# Altium schematic sheet 0238_GPU GDDR DEVICE DE.SchDoc
size 848 x 558 mm
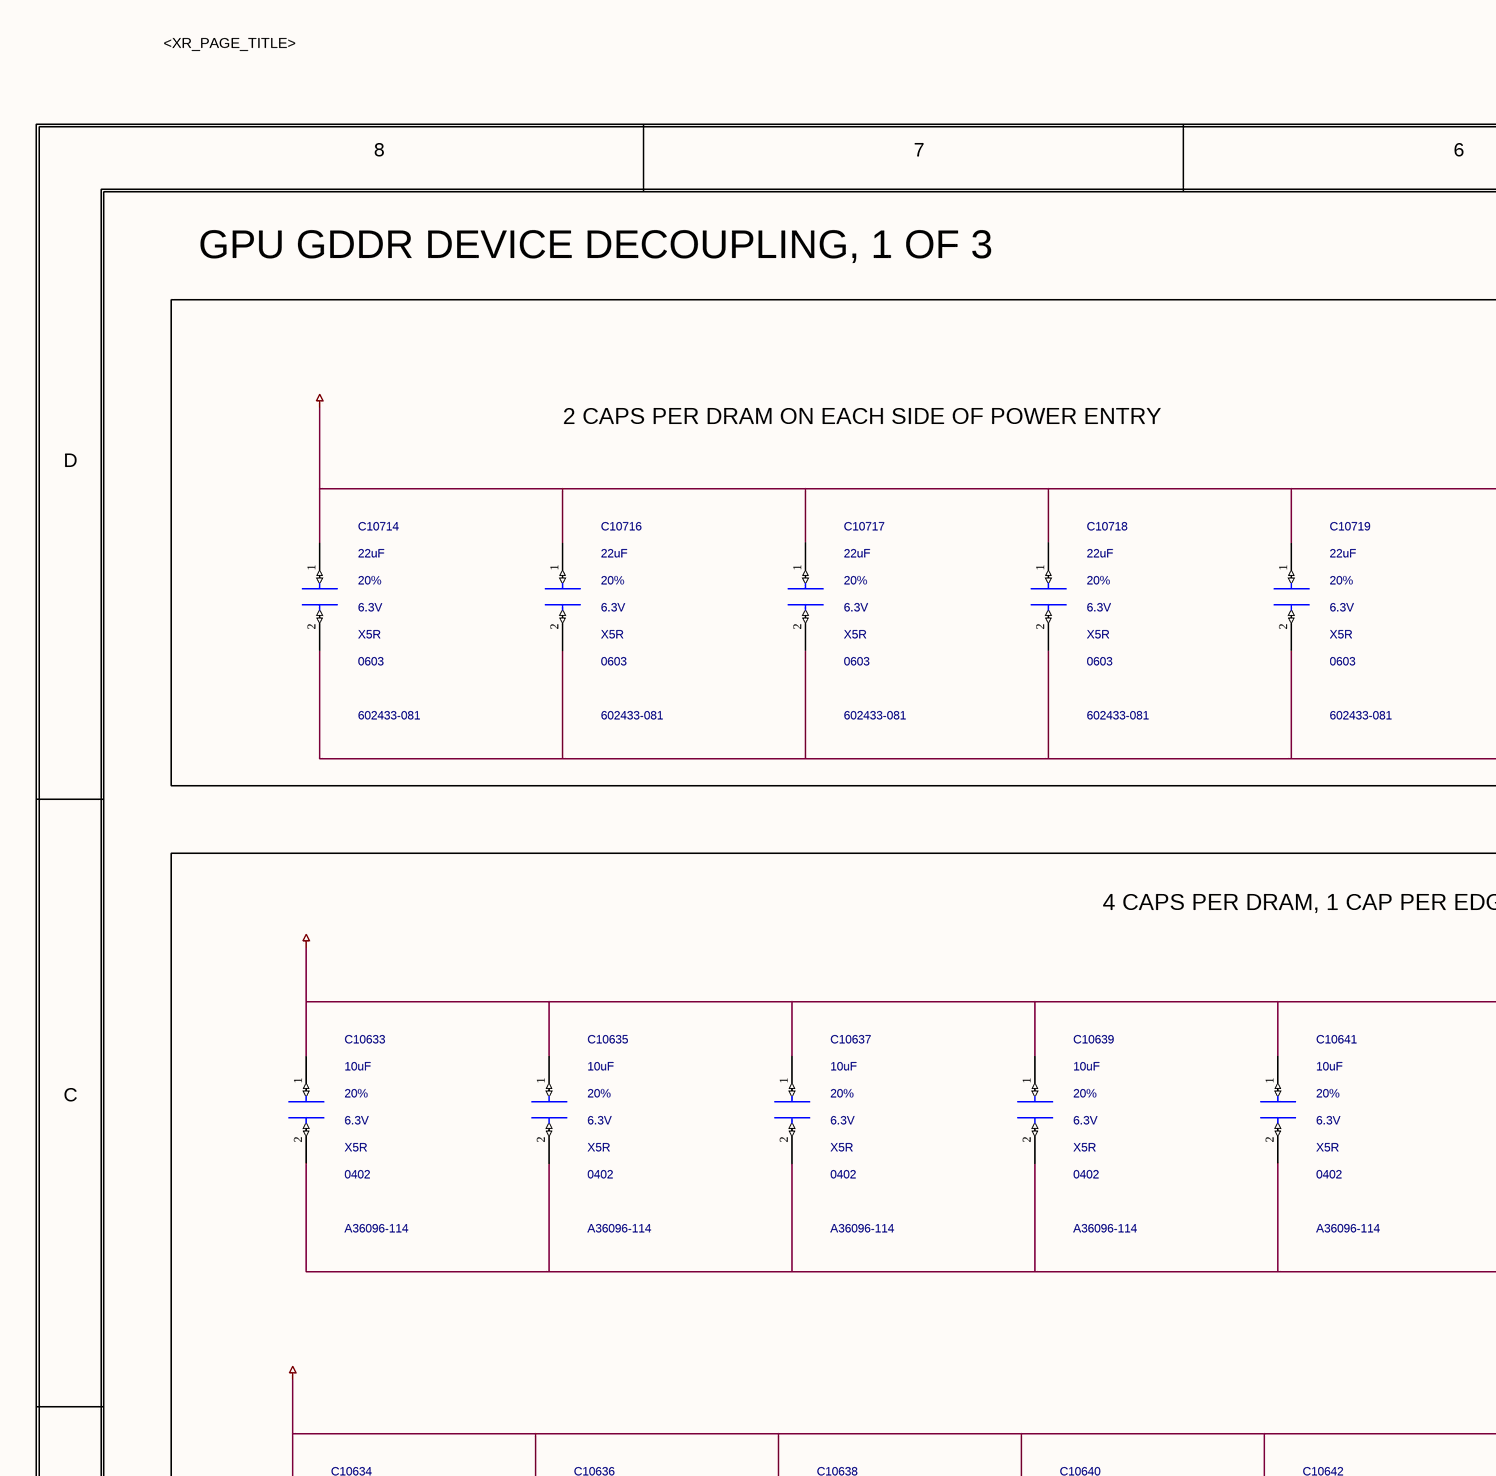
[diagram p0: 0238_GPU GDDR DEVICE DE.SchDoc, top left]
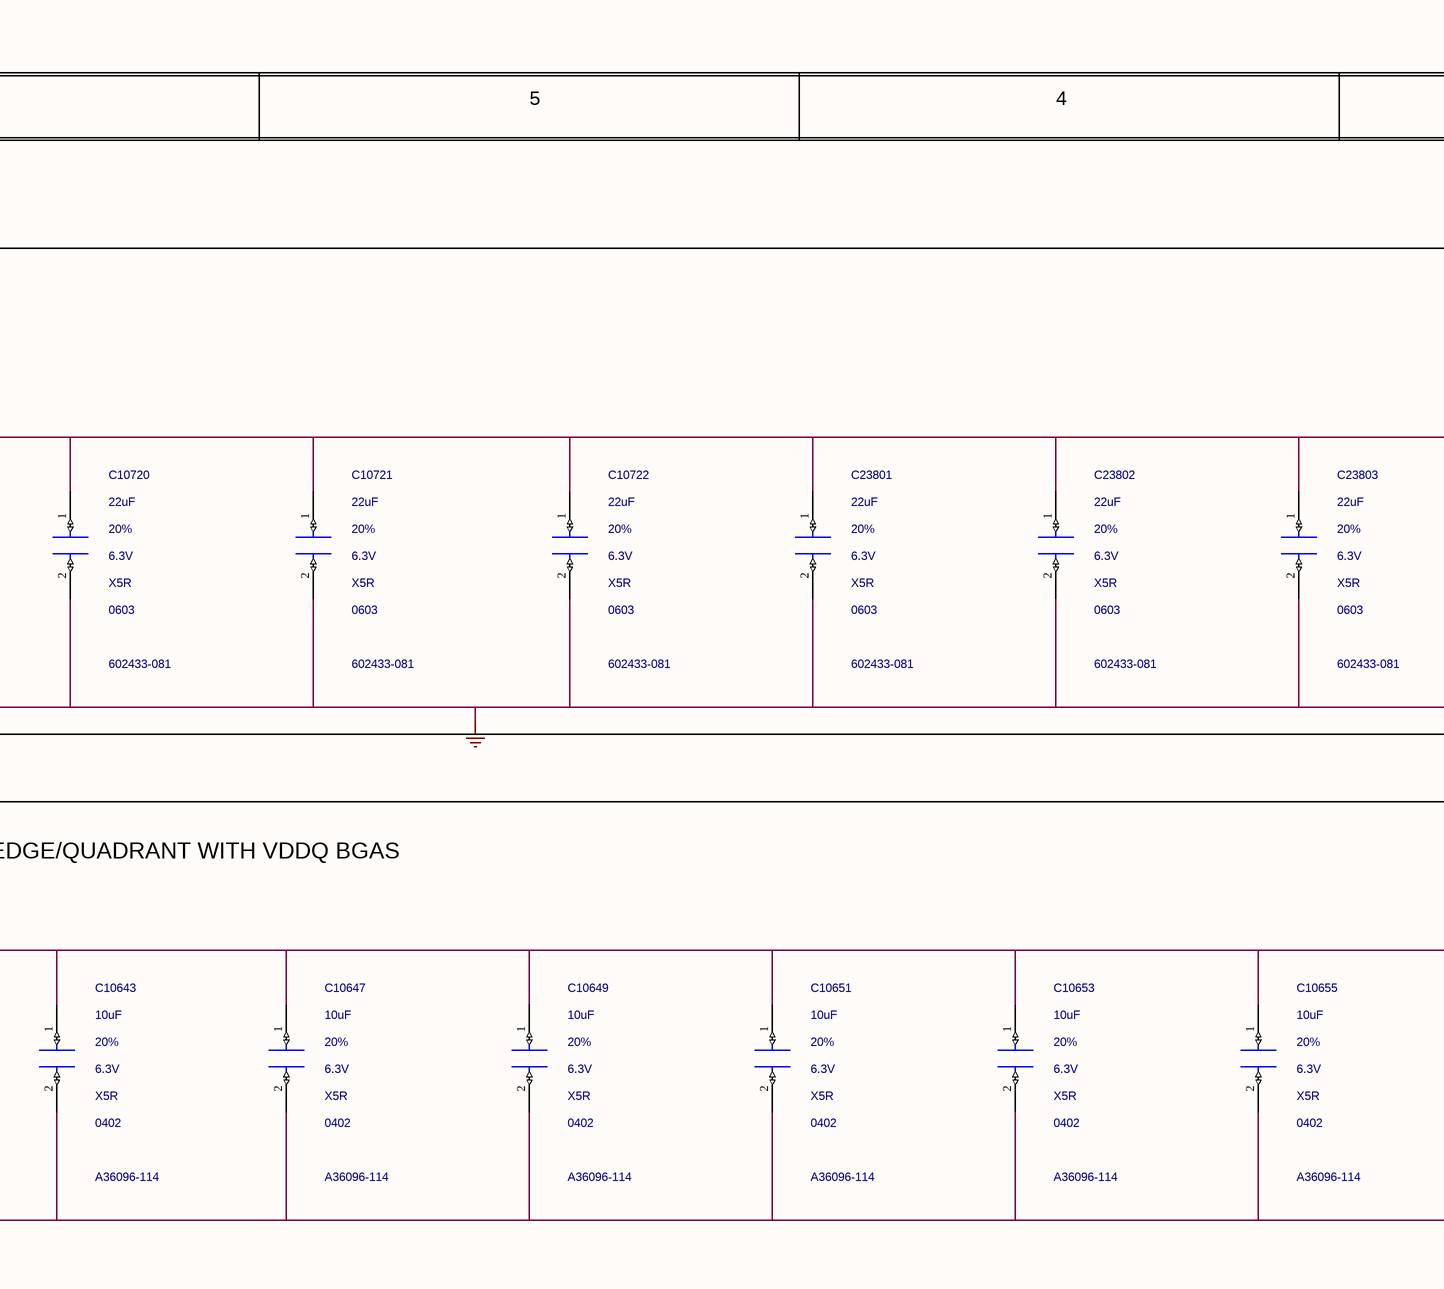
[diagram p1: 0238_GPU GDDR DEVICE DE.SchDoc, top middle]
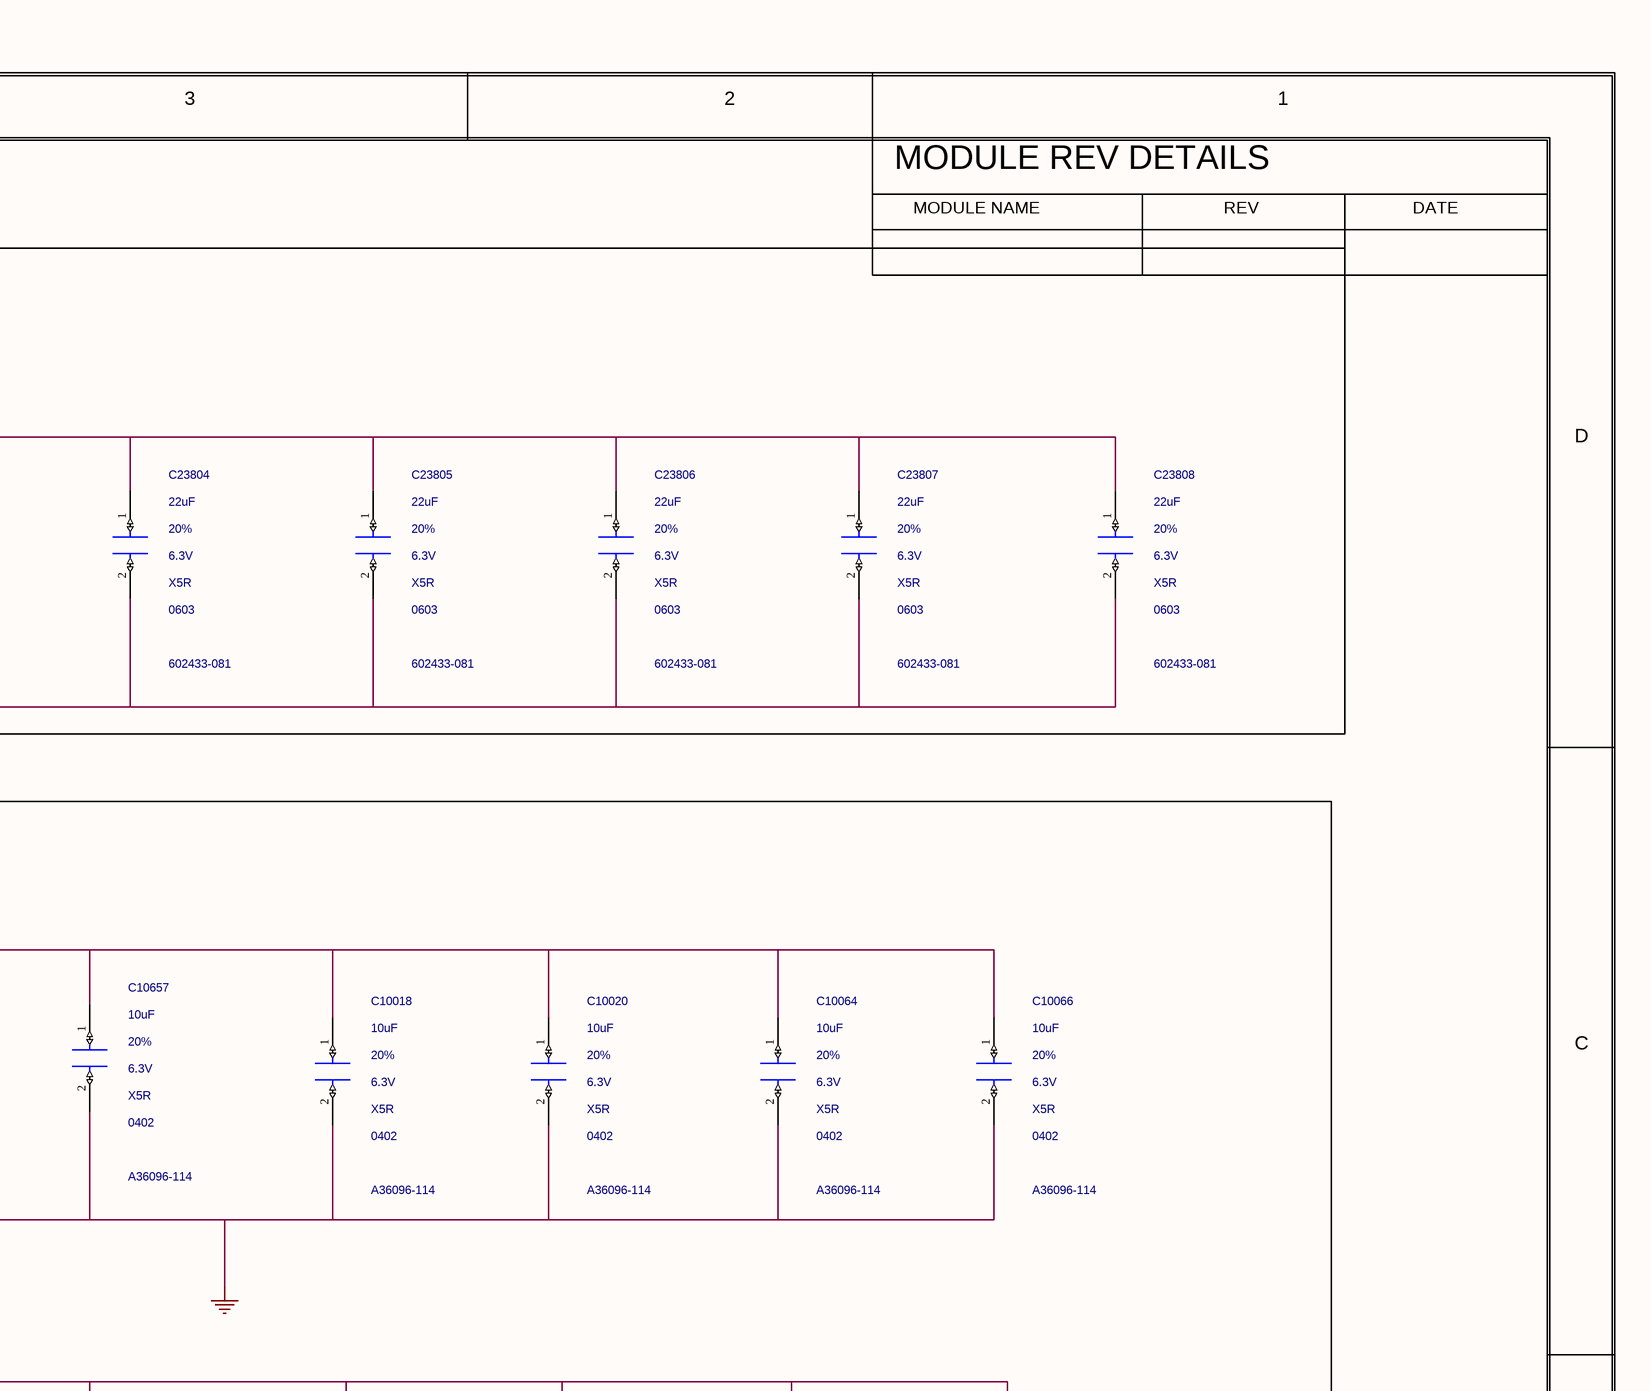
[diagram p2: 0238_GPU GDDR DEVICE DE.SchDoc, top right]
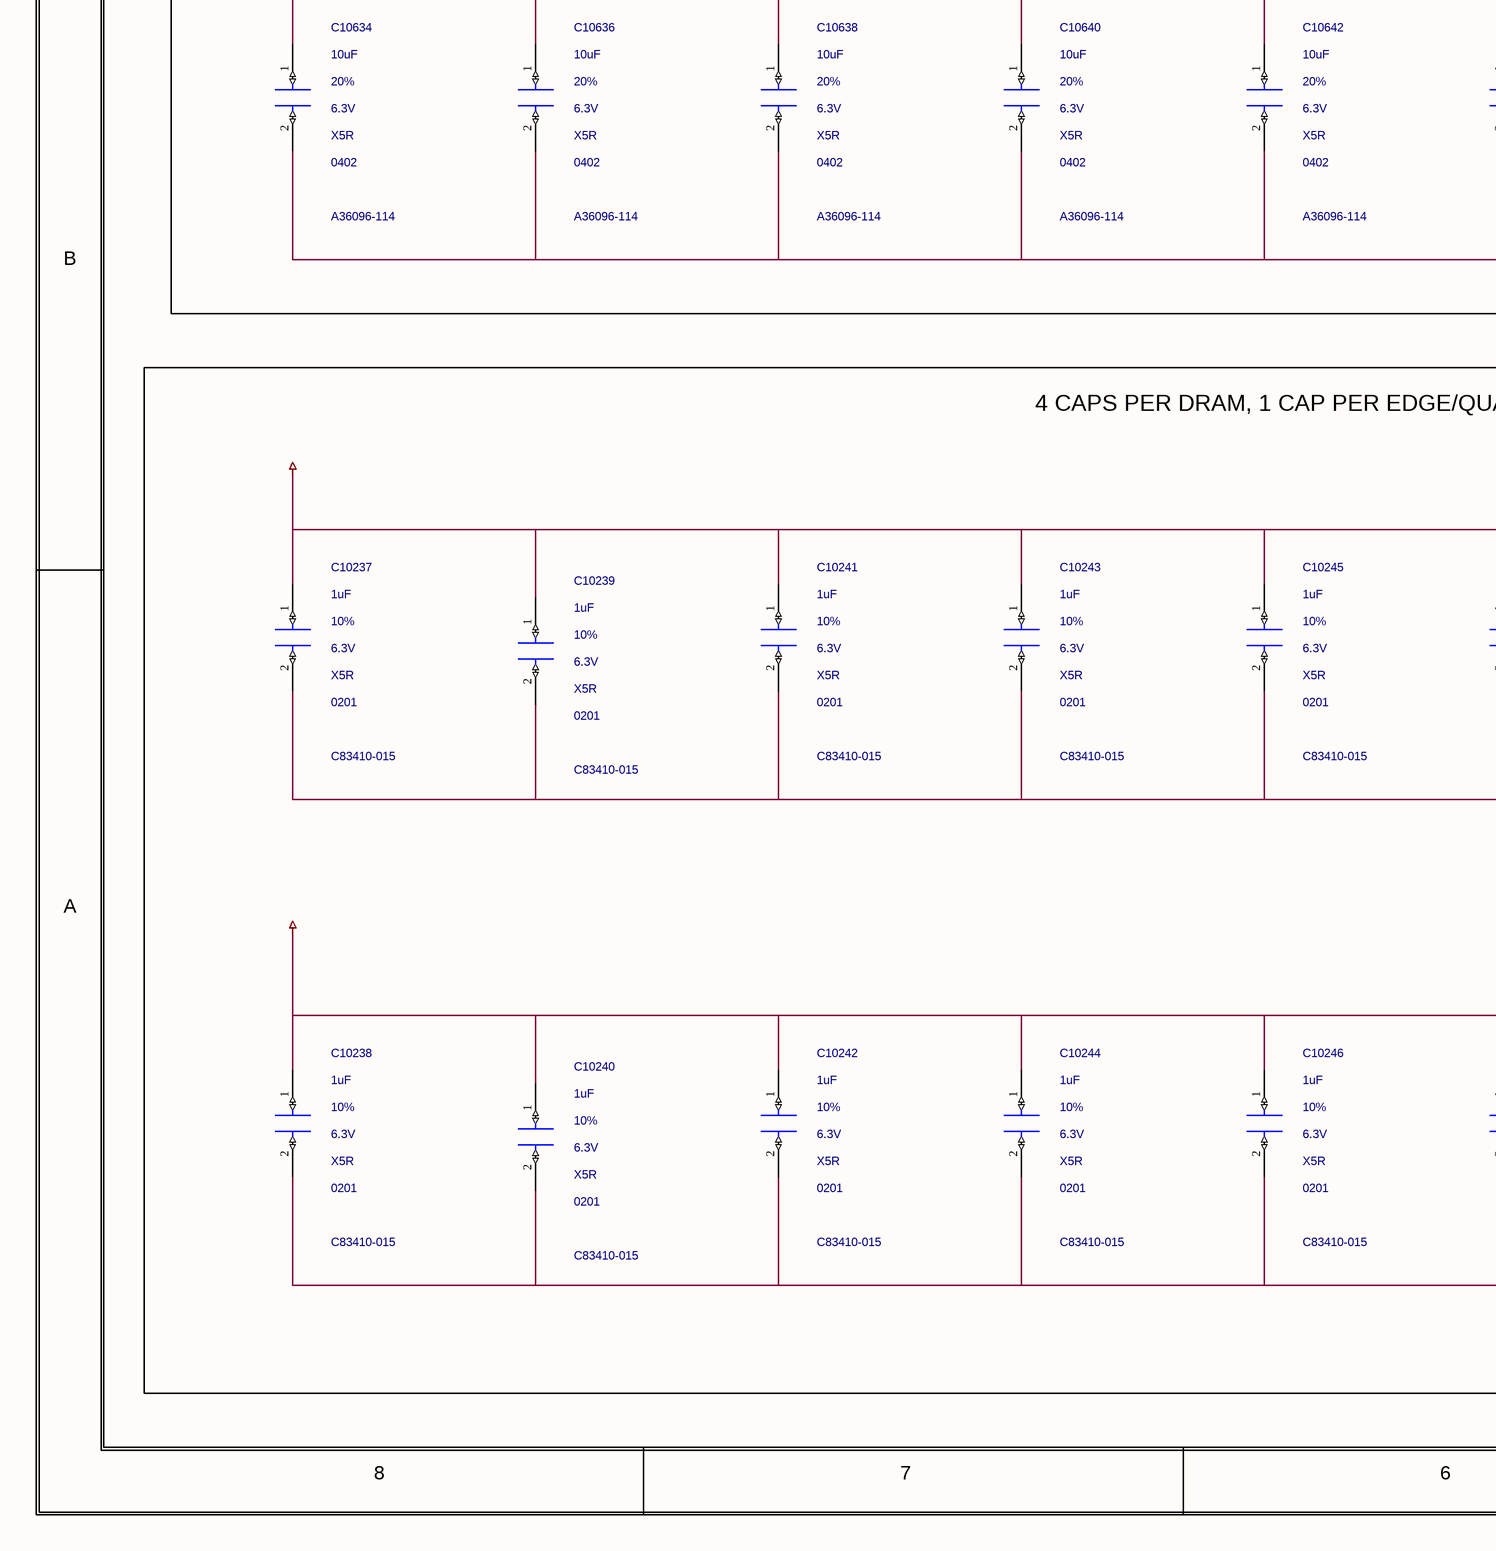
[diagram p3: 0238_GPU GDDR DEVICE DE.SchDoc, bottom left]
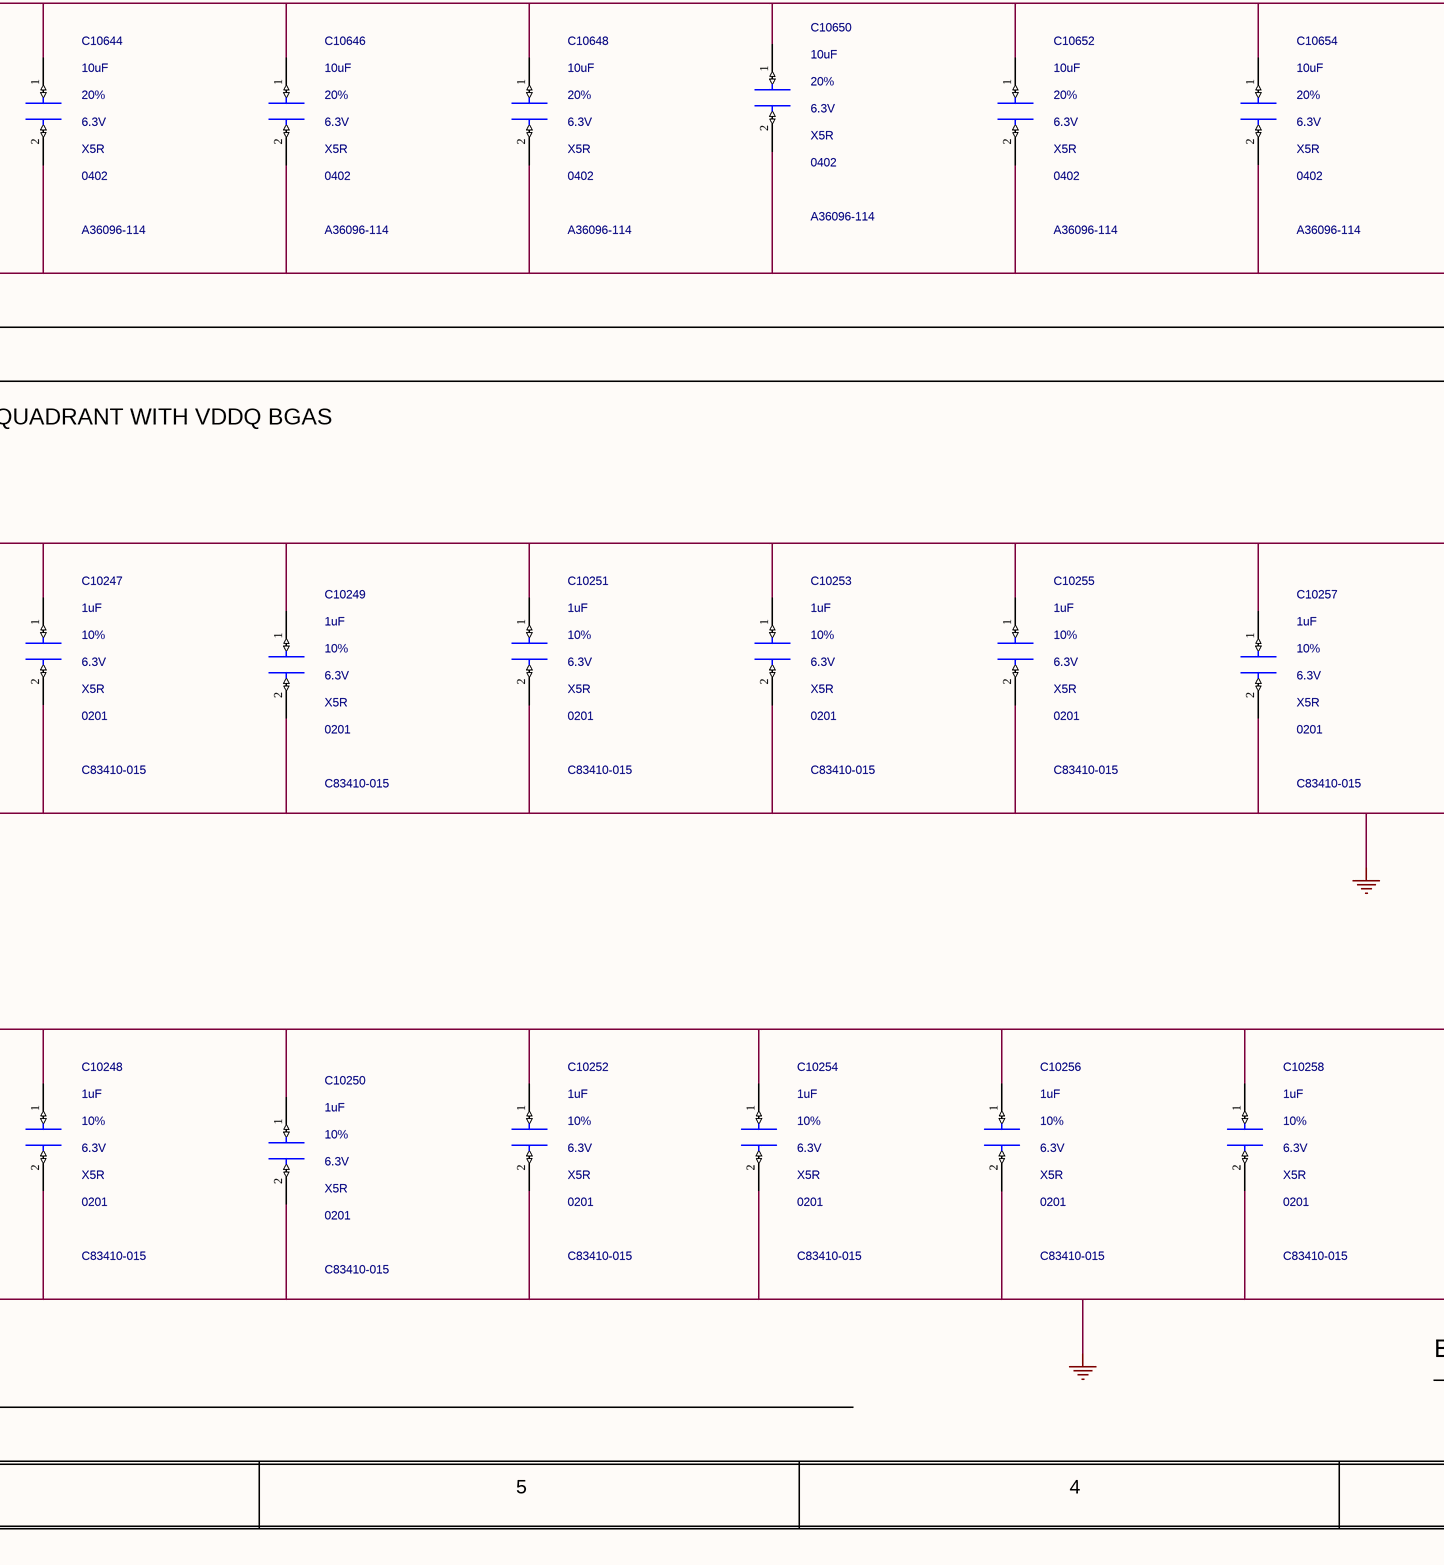
[diagram p4: 0238_GPU GDDR DEVICE DE.SchDoc, bottom middle]
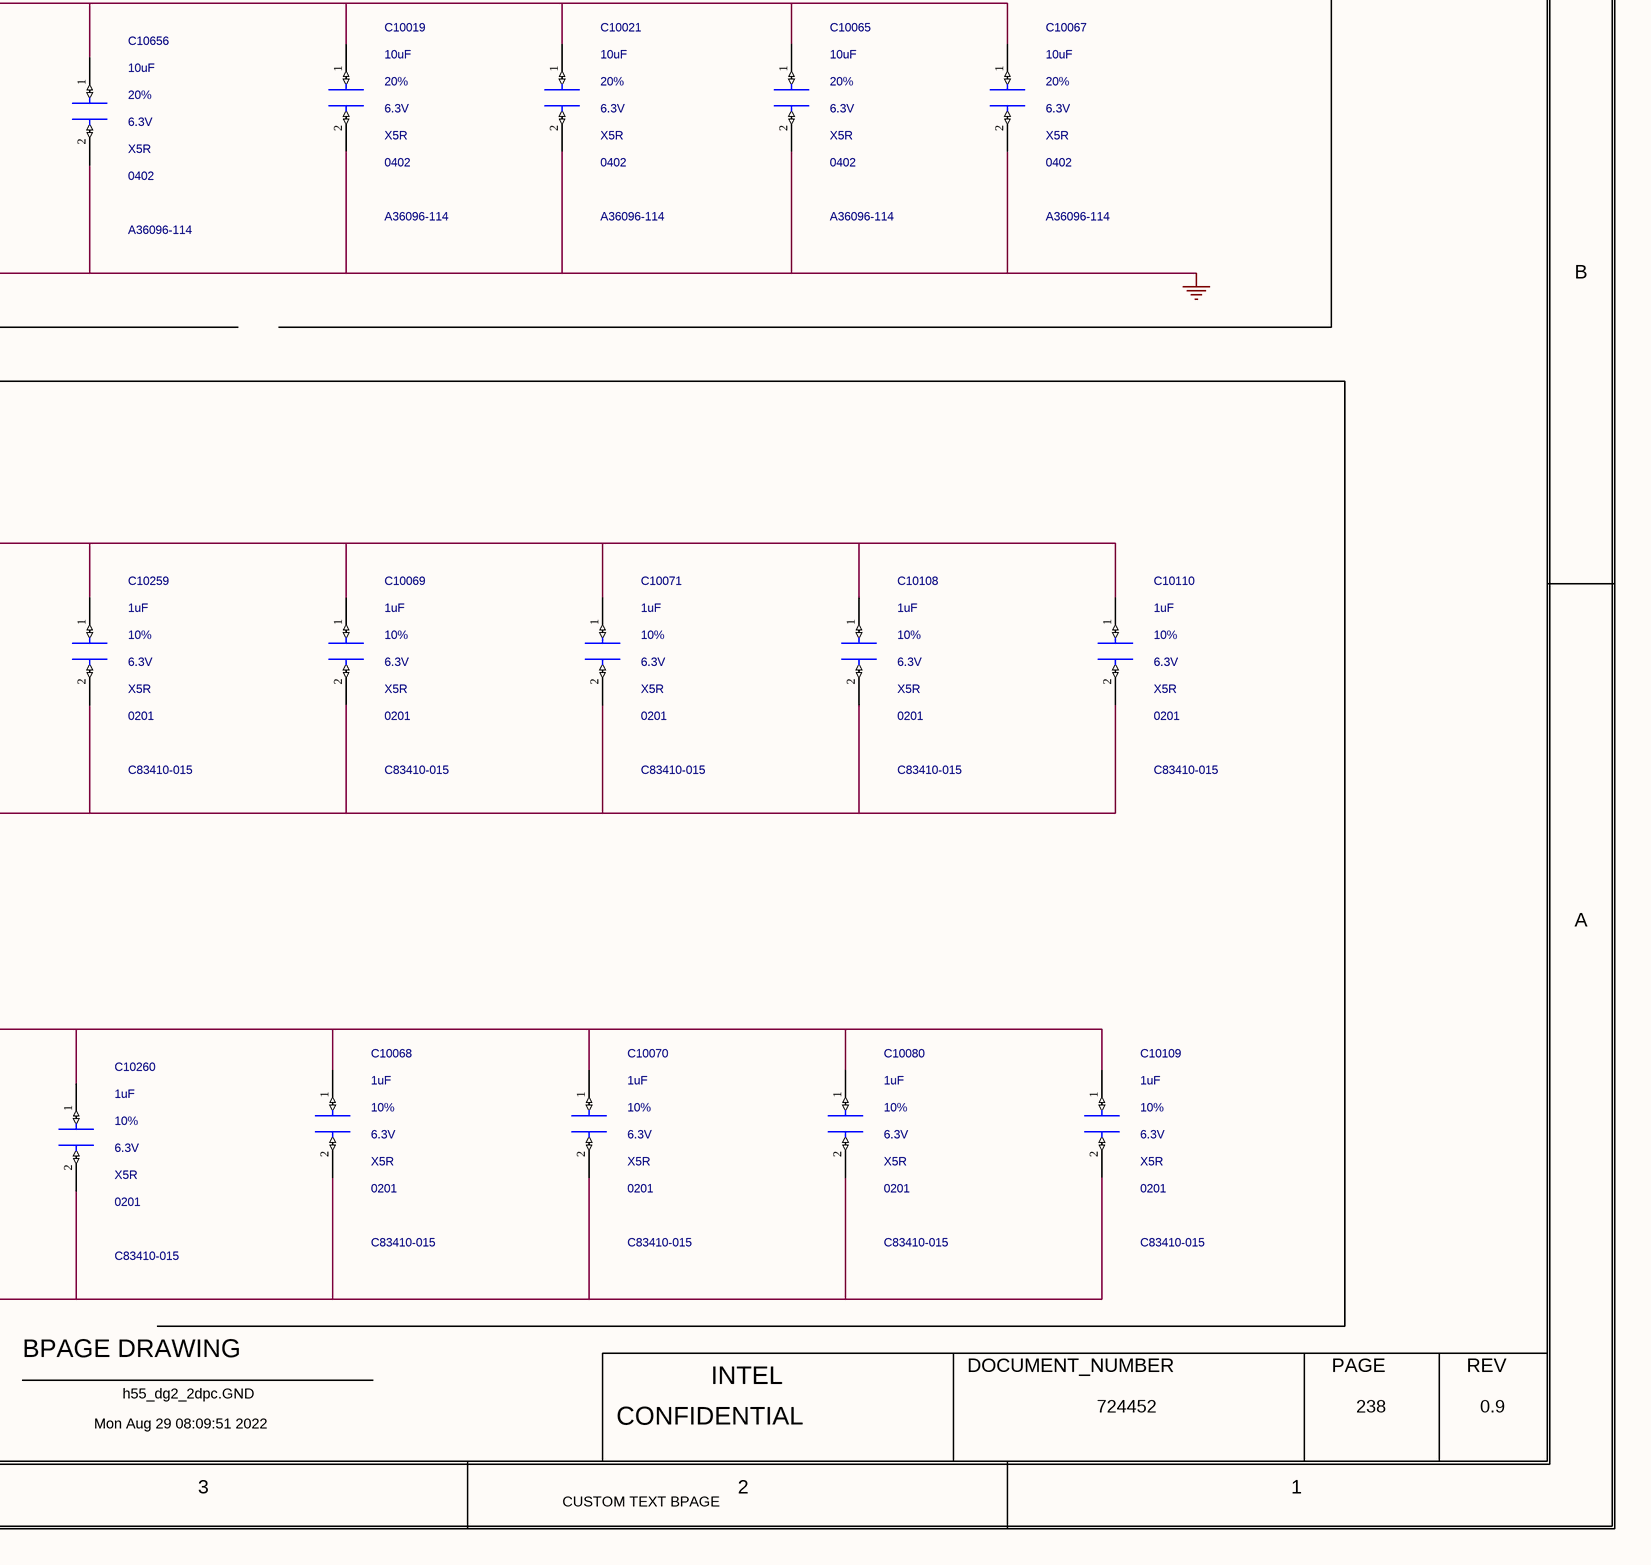
[diagram p5: 0238_GPU GDDR DEVICE DE.SchDoc, bottom right]

## Parts
C10018  10uF  MATERIAL: X5R  PACK_TYPE: 0402  PART_NUMBER: A36096-114  TOLERANCE: 20%  VOLTAGE: 6.3V  [SMC0402IA]
C10019  10uF  MATERIAL: X5R  PACK_TYPE: 0402  PART_NUMBER: A36096-114  TOLERANCE: 20%  VOLTAGE: 6.3V  [SMC0402IA]
C10020  10uF  MATERIAL: X5R  PACK_TYPE: 0402  PART_NUMBER: A36096-114  TOLERANCE: 20%  VOLTAGE: 6.3V  [SMC0402IA]
C10021  10uF  MATERIAL: X5R  PACK_TYPE: 0402  PART_NUMBER: A36096-114  TOLERANCE: 20%  VOLTAGE: 6.3V  [SMC0402IA]
C10064  10uF  MATERIAL: X5R  PACK_TYPE: 0402  PART_NUMBER: A36096-114  TOLERANCE: 20%  VOLTAGE: 6.3V  [SMC0402IA]
C10065  10uF  MATERIAL: X5R  PACK_TYPE: 0402  PART_NUMBER: A36096-114  TOLERANCE: 20%  VOLTAGE: 6.3V  [SMC0402IA]
C10066  10uF  MATERIAL: X5R  PACK_TYPE: 0402  PART_NUMBER: A36096-114  TOLERANCE: 20%  VOLTAGE: 6.3V  [SMC0402IA]
C10067  10uF  MATERIAL: X5R  PACK_TYPE: 0402  PART_NUMBER: A36096-114  TOLERANCE: 20%  VOLTAGE: 6.3V  [SMC0402IA]
C10068  1uF  MATERIAL: X5R  PACK_TYPE: 0201  PART_NUMBER: C83410-015  TOLERANCE: 10%  VOLTAGE: 6.3V  [SMC0201IA]
C10069  1uF  MATERIAL: X5R  PACK_TYPE: 0201  PART_NUMBER: C83410-015  TOLERANCE: 10%  VOLTAGE: 6.3V  [SMC0201IA]
C10070  1uF  MATERIAL: X5R  PACK_TYPE: 0201  PART_NUMBER: C83410-015  TOLERANCE: 10%  VOLTAGE: 6.3V  [SMC0201IA]
C10071  1uF  MATERIAL: X5R  PACK_TYPE: 0201  PART_NUMBER: C83410-015  TOLERANCE: 10%  VOLTAGE: 6.3V  [SMC0201IA]
C10080  1uF  MATERIAL: X5R  PACK_TYPE: 0201  PART_NUMBER: C83410-015  TOLERANCE: 10%  VOLTAGE: 6.3V  [SMC0201IA]
C10108  1uF  MATERIAL: X5R  PACK_TYPE: 0201  PART_NUMBER: C83410-015  TOLERANCE: 10%  VOLTAGE: 6.3V  [SMC0201IA]
C10109  1uF  MATERIAL: X5R  PACK_TYPE: 0201  PART_NUMBER: C83410-015  TOLERANCE: 10%  VOLTAGE: 6.3V  [SMC0201IA]
C10110  1uF  MATERIAL: X5R  PACK_TYPE: 0201  PART_NUMBER: C83410-015  TOLERANCE: 10%  VOLTAGE: 6.3V  [SMC0201IA]
C10237  1uF  MATERIAL: X5R  PACK_TYPE: 0201  PART_NUMBER: C83410-015  TOLERANCE: 10%  VOLTAGE: 6.3V  [SMC0201IA]
C10238  1uF  MATERIAL: X5R  PACK_TYPE: 0201  PART_NUMBER: C83410-015  TOLERANCE: 10%  VOLTAGE: 6.3V  [SMC0201IA]
C10239  1uF  MATERIAL: X5R  PACK_TYPE: 0201  PART_NUMBER: C83410-015  TOLERANCE: 10%  VOLTAGE: 6.3V  [SMC0201IA]
C10240  1uF  MATERIAL: X5R  PACK_TYPE: 0201  PART_NUMBER: C83410-015  TOLERANCE: 10%  VOLTAGE: 6.3V  [SMC0201IA]
C10241  1uF  MATERIAL: X5R  PACK_TYPE: 0201  PART_NUMBER: C83410-015  TOLERANCE: 10%  VOLTAGE: 6.3V  [SMC0201IA]
C10242  1uF  MATERIAL: X5R  PACK_TYPE: 0201  PART_NUMBER: C83410-015  TOLERANCE: 10%  VOLTAGE: 6.3V  [SMC0201IA]
C10243  1uF  MATERIAL: X5R  PACK_TYPE: 0201  PART_NUMBER: C83410-015  TOLERANCE: 10%  VOLTAGE: 6.3V  [SMC0201IA]
C10244  1uF  MATERIAL: X5R  PACK_TYPE: 0201  PART_NUMBER: C83410-015  TOLERANCE: 10%  VOLTAGE: 6.3V  [SMC0201IA]
C10245  1uF  MATERIAL: X5R  PACK_TYPE: 0201  PART_NUMBER: C83410-015  TOLERANCE: 10%  VOLTAGE: 6.3V  [SMC0201IA]
C10246  1uF  MATERIAL: X5R  PACK_TYPE: 0201  PART_NUMBER: C83410-015  TOLERANCE: 10%  VOLTAGE: 6.3V  [SMC0201IA]
C10247  1uF  MATERIAL: X5R  PACK_TYPE: 0201  PART_NUMBER: C83410-015  TOLERANCE: 10%  VOLTAGE: 6.3V  [SMC0201IA]
C10248  1uF  MATERIAL: X5R  PACK_TYPE: 0201  PART_NUMBER: C83410-015  TOLERANCE: 10%  VOLTAGE: 6.3V  [SMC0201IA]
C10249  1uF  MATERIAL: X5R  PACK_TYPE: 0201  PART_NUMBER: C83410-015  TOLERANCE: 10%  VOLTAGE: 6.3V  [SMC0201IA]
C10250  1uF  MATERIAL: X5R  PACK_TYPE: 0201  PART_NUMBER: C83410-015  TOLERANCE: 10%  VOLTAGE: 6.3V  [SMC0201IA]
C10251  1uF  MATERIAL: X5R  PACK_TYPE: 0201  PART_NUMBER: C83410-015  TOLERANCE: 10%  VOLTAGE: 6.3V  [SMC0201IA]
C10252  1uF  MATERIAL: X5R  PACK_TYPE: 0201  PART_NUMBER: C83410-015  TOLERANCE: 10%  VOLTAGE: 6.3V  [SMC0201IA]
C10253  1uF  MATERIAL: X5R  PACK_TYPE: 0201  PART_NUMBER: C83410-015  TOLERANCE: 10%  VOLTAGE: 6.3V  [SMC0201IA]
C10254  1uF  MATERIAL: X5R  PACK_TYPE: 0201  PART_NUMBER: C83410-015  TOLERANCE: 10%  VOLTAGE: 6.3V  [SMC0201IA]
C10255  1uF  MATERIAL: X5R  PACK_TYPE: 0201  PART_NUMBER: C83410-015  TOLERANCE: 10%  VOLTAGE: 6.3V  [SMC0201IA]
C10256  1uF  MATERIAL: X5R  PACK_TYPE: 0201  PART_NUMBER: C83410-015  TOLERANCE: 10%  VOLTAGE: 6.3V  [SMC0201IA]
C10257  1uF  MATERIAL: X5R  PACK_TYPE: 0201  PART_NUMBER: C83410-015  TOLERANCE: 10%  VOLTAGE: 6.3V  [SMC0201IA]
C10258  1uF  MATERIAL: X5R  PACK_TYPE: 0201  PART_NUMBER: C83410-015  TOLERANCE: 10%  VOLTAGE: 6.3V  [SMC0201IA]
C10259  1uF  MATERIAL: X5R  PACK_TYPE: 0201  PART_NUMBER: C83410-015  TOLERANCE: 10%  VOLTAGE: 6.3V  [SMC0201IA]
C10260  1uF  MATERIAL: X5R  PACK_TYPE: 0201  PART_NUMBER: C83410-015  TOLERANCE: 10%  VOLTAGE: 6.3V  [SMC0201IA]
C10633  10uF  MATERIAL: X5R  PACK_TYPE: 0402  PART_NUMBER: A36096-114  TOLERANCE: 20%  VOLTAGE: 6.3V  [SMC0402IA]
C10634  10uF  MATERIAL: X5R  PACK_TYPE: 0402  PART_NUMBER: A36096-114  TOLERANCE: 20%  VOLTAGE: 6.3V  [SMC0402IA]
C10635  10uF  MATERIAL: X5R  PACK_TYPE: 0402  PART_NUMBER: A36096-114  TOLERANCE: 20%  VOLTAGE: 6.3V  [SMC0402IA]
C10636  10uF  MATERIAL: X5R  PACK_TYPE: 0402  PART_NUMBER: A36096-114  TOLERANCE: 20%  VOLTAGE: 6.3V  [SMC0402IA]
C10637  10uF  MATERIAL: X5R  PACK_TYPE: 0402  PART_NUMBER: A36096-114  TOLERANCE: 20%  VOLTAGE: 6.3V  [SMC0402IA]
C10638  10uF  MATERIAL: X5R  PACK_TYPE: 0402  PART_NUMBER: A36096-114  TOLERANCE: 20%  VOLTAGE: 6.3V  [SMC0402IA]
C10639  10uF  MATERIAL: X5R  PACK_TYPE: 0402  PART_NUMBER: A36096-114  TOLERANCE: 20%  VOLTAGE: 6.3V  [SMC0402IA]
C10640  10uF  MATERIAL: X5R  PACK_TYPE: 0402  PART_NUMBER: A36096-114  TOLERANCE: 20%  VOLTAGE: 6.3V  [SMC0402IA]
C10641  10uF  MATERIAL: X5R  PACK_TYPE: 0402  PART_NUMBER: A36096-114  TOLERANCE: 20%  VOLTAGE: 6.3V  [SMC0402IA]
C10642  10uF  MATERIAL: X5R  PACK_TYPE: 0402  PART_NUMBER: A36096-114  TOLERANCE: 20%  VOLTAGE: 6.3V  [SMC0402IA]
C10643  10uF  MATERIAL: X5R  PACK_TYPE: 0402  PART_NUMBER: A36096-114  TOLERANCE: 20%  VOLTAGE: 6.3V  [SMC0402IA]
C10644  10uF  MATERIAL: X5R  PACK_TYPE: 0402  PART_NUMBER: A36096-114  TOLERANCE: 20%  VOLTAGE: 6.3V  [SMC0402IA]
C10646  10uF  MATERIAL: X5R  PACK_TYPE: 0402  PART_NUMBER: A36096-114  TOLERANCE: 20%  VOLTAGE: 6.3V  [SMC0402IA]
C10647  10uF  MATERIAL: X5R  PACK_TYPE: 0402  PART_NUMBER: A36096-114  TOLERANCE: 20%  VOLTAGE: 6.3V  [SMC0402IA]
C10648  10uF  MATERIAL: X5R  PACK_TYPE: 0402  PART_NUMBER: A36096-114  TOLERANCE: 20%  VOLTAGE: 6.3V  [SMC0402IA]
C10649  10uF  MATERIAL: X5R  PACK_TYPE: 0402  PART_NUMBER: A36096-114  TOLERANCE: 20%  VOLTAGE: 6.3V  [SMC0402IA]
C10650  10uF  MATERIAL: X5R  PACK_TYPE: 0402  PART_NUMBER: A36096-114  TOLERANCE: 20%  VOLTAGE: 6.3V  [SMC0402IA]
C10651  10uF  MATERIAL: X5R  PACK_TYPE: 0402  PART_NUMBER: A36096-114  TOLERANCE: 20%  VOLTAGE: 6.3V  [SMC0402IA]
C10652  10uF  MATERIAL: X5R  PACK_TYPE: 0402  PART_NUMBER: A36096-114  TOLERANCE: 20%  VOLTAGE: 6.3V  [SMC0402IA]
C10653  10uF  MATERIAL: X5R  PACK_TYPE: 0402  PART_NUMBER: A36096-114  TOLERANCE: 20%  VOLTAGE: 6.3V  [SMC0402IA]
C10654  10uF  MATERIAL: X5R  PACK_TYPE: 0402  PART_NUMBER: A36096-114  TOLERANCE: 20%  VOLTAGE: 6.3V  [SMC0402IA]
C10655  10uF  MATERIAL: X5R  PACK_TYPE: 0402  PART_NUMBER: A36096-114  TOLERANCE: 20%  VOLTAGE: 6.3V  [SMC0402IA]
C10656  10uF  MATERIAL: X5R  PACK_TYPE: 0402  PART_NUMBER: A36096-114  TOLERANCE: 20%  VOLTAGE: 6.3V  [SMC0402IA]
C10657  10uF  MATERIAL: X5R  PACK_TYPE: 0402  PART_NUMBER: A36096-114  TOLERANCE: 20%  VOLTAGE: 6.3V  [SMC0402IA]
C10714  22uF  MATERIAL: X5R  PACK_TYPE: 0603  PART_NUMBER: 602433-081  TOLERANCE: 20%  VOLTAGE: 6.3V  [SMC0603ID]
C10716  22uF  MATERIAL: X5R  PACK_TYPE: 0603  PART_NUMBER: 602433-081  TOLERANCE: 20%  VOLTAGE: 6.3V  [SMC0603ID]
C10717  22uF  MATERIAL: X5R  PACK_TYPE: 0603  PART_NUMBER: 602433-081  TOLERANCE: 20%  VOLTAGE: 6.3V  [SMC0603ID]
C10718  22uF  MATERIAL: X5R  PACK_TYPE: 0603  PART_NUMBER: 602433-081  TOLERANCE: 20%  VOLTAGE: 6.3V  [SMC0603ID]
C10719  22uF  MATERIAL: X5R  PACK_TYPE: 0603  PART_NUMBER: 602433-081  TOLERANCE: 20%  VOLTAGE: 6.3V  [SMC0603ID]
C10720  22uF  MATERIAL: X5R  PACK_TYPE: 0603  PART_NUMBER: 602433-081  TOLERANCE: 20%  VOLTAGE: 6.3V  [SMC0603ID]
C10721  22uF  MATERIAL: X5R  PACK_TYPE: 0603  PART_NUMBER: 602433-081  TOLERANCE: 20%  VOLTAGE: 6.3V  [SMC0603ID]
C10722  22uF  MATERIAL: X5R  PACK_TYPE: 0603  PART_NUMBER: 602433-081  TOLERANCE: 20%  VOLTAGE: 6.3V  [SMC0603ID]
C23801  22uF  MATERIAL: X5R  PACK_TYPE: 0603  PART_NUMBER: 602433-081  TOLERANCE: 20%  VOLTAGE: 6.3V  [SMC0603ID]
C23802  22uF  MATERIAL: X5R  PACK_TYPE: 0603  PART_NUMBER: 602433-081  TOLERANCE: 20%  VOLTAGE: 6.3V  [SMC0603ID]
C23803  22uF  MATERIAL: X5R  PACK_TYPE: 0603  PART_NUMBER: 602433-081  TOLERANCE: 20%  VOLTAGE: 6.3V  [SMC0603ID]
C23804  22uF  MATERIAL: X5R  PACK_TYPE: 0603  PART_NUMBER: 602433-081  TOLERANCE: 20%  VOLTAGE: 6.3V  [SMC0603ID]
C23805  22uF  MATERIAL: X5R  PACK_TYPE: 0603  PART_NUMBER: 602433-081  TOLERANCE: 20%  VOLTAGE: 6.3V  [SMC0603ID]
C23806  22uF  MATERIAL: X5R  PACK_TYPE: 0603  PART_NUMBER: 602433-081  TOLERANCE: 20%  VOLTAGE: 6.3V  [SMC0603ID]
C23807  22uF  MATERIAL: X5R  PACK_TYPE: 0603  PART_NUMBER: 602433-081  TOLERANCE: 20%  VOLTAGE: 6.3V  [SMC0603ID]
C23808  22uF  MATERIAL: X5R  PACK_TYPE: 0603  PART_NUMBER: 602433-081  TOLERANCE: 20%  VOLTAGE: 6.3V  [SMC0603ID]

## Blocks framed on the sheet
2 CAPS PER DRAM ON EACH SIDE OF POWER ENTRY: C10714 C10716-C10722 C23801-C23808

## Nets
+VDD_GDDR6: C10714.1(A) C10716.1(A) C10717.1(A) C10718.1(A) C10719.1(A) C10720.1(A) C10721.1(A) C10722.1(A) C23801.1(A) C23802.1(A) C23803.1(A) C23804.1(A) C23805.1(A) C23806.1(A) C23807.1(A) C23808.1(A)
+VDDQ_GPU: C10018.1(A) C10019.1(A) C10020.1(A) C10021.1(A) C10064.1(A) C10065.1(A) C10066.1(A) C10067.1(A) C10068.1(A) C10069.1(A) C10070.1(A) C10071.1(A) C10080.1(A) C10108.1(A) C10109.1(A) C10110.1(A) C10237.1(A) C10238.1(A) C10239.1(A) C10240.1(A) C10241.1(A) C10242.1(A) C10243.1(A) C10244.1(A) C10245.1(A) C10246.1(A) C10247.1(A) C10248.1(A) C10249.1(A) C10250.1(A) C10251.1(A) C10252.1(A) C10253.1(A) C10254.1(A) C10255.1(A) C10256.1(A) C10257.1(A) C10258.1(A) C10259.1(A) C10260.1(A) C10633.1(A) C10634.1(A) C10635.1(A) C10636.1(A) C10637.1(A) C10638.1(A) C10639.1(A) C10640.1(A) C10641.1(A) C10642.1(A) C10643.1(A) C10644.1(A) C10646.1(A) C10647.1(A) C10648.1(A) C10649.1(A) C10650.1(A) C10651.1(A) C10652.1(A) C10653.1(A) C10654.1(A) C10655.1(A) C10656.1(A) C10657.1(A)
GND: C10018.2(B) C10019.2(B) C10020.2(B) C10021.2(B) C10064.2(B) C10065.2(B) C10066.2(B) C10067.2(B) C10068.2(B) C10069.2(B) C10070.2(B) C10071.2(B) C10080.2(B) C10108.2(B) C10109.2(B) C10110.2(B) C10237.2(B) C10238.2(B) C10239.2(B) C10240.2(B) C10241.2(B) C10242.2(B) C10243.2(B) C10244.2(B) C10245.2(B) C10246.2(B) C10247.2(B) C10248.2(B) C10249.2(B) C10250.2(B) C10251.2(B) C10252.2(B) C10253.2(B) C10254.2(B) C10255.2(B) C10256.2(B) C10257.2(B) C10258.2(B) C10259.2(B) C10260.2(B) C10633.2(B) C10634.2(B) C10635.2(B) C10636.2(B) C10637.2(B) C10638.2(B) C10639.2(B) C10640.2(B) C10641.2(B) C10642.2(B) C10643.2(B) C10644.2(B) C10646.2(B) C10647.2(B) C10648.2(B) C10649.2(B) C10650.2(B) C10651.2(B) C10652.2(B) C10653.2(B) C10654.2(B) C10655.2(B) C10656.2(B) C10657.2(B) C10714.2(B) C10716.2(B) C10717.2(B) C10718.2(B) C10719.2(B) C10720.2(B) C10721.2(B) C10722.2(B) C23801.2(B) C23802.2(B) C23803.2(B) C23804.2(B) C23805.2(B) C23806.2(B) C23807.2(B) C23808.2(B)

## Notes on the sheet
- <XR_PAGE_TITLE>
- 8
- 7
- 6
- 5
- 4
- 3
- 2
- 1
- MODULE REV DETAILS
- GPU GDDR DEVICE DECOUPLING, 1 OF 3
- MODULE NAME
- REV
- DATE
- D
- 4 CAPS PER DRAM, 1 CAP PER EDGE/QUADRANT WITH VDDQ BGAS
- C
- B
- A
- BPAGE DRAWING
- INTEL
- DOCUMENT_NUMBER
- PAGE
- Mon Aug 29 08:09:51 2022
- h55_dg2_2dpc.GND
- CONFIDENTIAL
- 724452
- 238
- 0.9
- CUSTOM TEXT BPAGE

## Library data of the parts
C10018 = CAP: CDS_PHYS_PART_NAME: CAP_0402-A36096-114,X5R,10UF,6.3V,20%,LPDB,GENERIC; OriginalSymbolOrigin: (-50,25); XY: (-2250,3275); VER: 1; ROT: 0; PHYS_PAGE: 238; LOCATION: C10018; DRAWING: @RVP1_ADL_SB_ADP_S_DDR5_SODIMM_2DPC_LIB.H55_DG2_2DPC(SCH_1):PAGE409; CDS_LIB: discrete; PCB Footprint: SMC0402IA; CHIPS_PART_NAME: CAP; CDS_PART_NAME: CAP_0402-A36096-114,X5R,10UF,6.3V,20%,LPDB,GENERIC; CDS_LOCATION: C10018
C10019 = CAP: CDS_PHYS_PART_NAME: CAP_0402-A36096-114,X5R,10UF,6.3V,20%,LPDB,GENERIC; OriginalSymbolOrigin: (-50,25); XY: (-2225,2525); VER: 1; ROT: 0; PHYS_PAGE: 238; LOCATION: C10019; DRAWING: @RVP1_ADL_SB_ADP_S_DDR5_SODIMM_2DPC_LIB.H55_DG2_2DPC(SCH_1):PAGE409; CDS_LIB: discrete; PCB Footprint: SMC0402IA; CHIPS_PART_NAME: CAP; CDS_PART_NAME: CAP_0402-A36096-114,X5R,10UF,6.3V,20%,LPDB,GENERIC; CDS_LOCATION: C10019
C10020 = CAP: CDS_PHYS_PART_NAME: CAP_0402-A36096-114,X5R,10UF,6.3V,20%,LPDB,GENERIC; OriginalSymbolOrigin: (-50,25); XY: (-1850,3275); VER: 1; ROT: 0; PHYS_PAGE: 238; LOCATION: C10020; DRAWING: @RVP1_ADL_SB_ADP_S_DDR5_SODIMM_2DPC_LIB.H55_DG2_2DPC(SCH_1):PAGE409; CDS_LIB: discrete; PCB Footprint: SMC0402IA; CHIPS_PART_NAME: CAP; CDS_PART_NAME: CAP_0402-A36096-114,X5R,10UF,6.3V,20%,LPDB,GENERIC; CDS_LOCATION: C10020
C10021 = CAP: CDS_PHYS_PART_NAME: CAP_0402-A36096-114,X5R,10UF,6.3V,20%,LPDB,GENERIC; OriginalSymbolOrigin: (-50,25); XY: (-1825,2525); VER: 1; ROT: 0; PHYS_PAGE: 238; LOCATION: C10021; DRAWING: @RVP1_ADL_SB_ADP_S_DDR5_SODIMM_2DPC_LIB.H55_DG2_2DPC(SCH_1):PAGE409; CDS_LIB: discrete; PCB Footprint: SMC0402IA; CHIPS_PART_NAME: CAP; CDS_PART_NAME: CAP_0402-A36096-114,X5R,10UF,6.3V,20%,LPDB,GENERIC; CDS_LOCATION: C10021
C10064 = CAP: CDS_PHYS_PART_NAME: CAP_0402-A36096-114,X5R,10UF,6.3V,20%,LPDB,GENERIC; OriginalSymbolOrigin: (-50,25); XY: (-1425,3275); VER: 1; ROT: 0; PHYS_PAGE: 238; LOCATION: C10064; DRAWING: @RVP1_ADL_SB_ADP_S_DDR5_SODIMM_2DPC_LIB.H55_DG2_2DPC(SCH_1):PAGE409; CDS_LIB: discrete; PCB Footprint: SMC0402IA; CHIPS_PART_NAME: CAP; CDS_PART_NAME: CAP_0402-A36096-114,X5R,10UF,6.3V,20%,LPDB,GENERIC; CDS_LOCATION: C10064
C10065 = CAP: CDS_PHYS_PART_NAME: CAP_0402-A36096-114,X5R,10UF,6.3V,20%,LPDB,GENERIC; OriginalSymbolOrigin: (-50,25); XY: (-1400,2525); VER: 1; ROT: 0; PHYS_PAGE: 238; LOCATION: C10065; DRAWING: @RVP1_ADL_SB_ADP_S_DDR5_SODIMM_2DPC_LIB.H55_DG2_2DPC(SCH_1):PAGE409; CDS_LIB: discrete; PCB Footprint: SMC0402IA; CHIPS_PART_NAME: CAP; CDS_PART_NAME: CAP_0402-A36096-114,X5R,10UF,6.3V,20%,LPDB,GENERIC; CDS_LOCATION: C10065
C10066 = CAP: CDS_PHYS_PART_NAME: CAP_0402-A36096-114,X5R,10UF,6.3V,20%,LPDB,GENERIC; OriginalSymbolOrigin: (-50,25); XY: (-1025,3275); VER: 1; ROT: 0; PHYS_PAGE: 238; LOCATION: C10066; DRAWING: @RVP1_ADL_SB_ADP_S_DDR5_SODIMM_2DPC_LIB.H55_DG2_2DPC(SCH_1):PAGE409; CDS_LIB: discrete; PCB Footprint: SMC0402IA; CHIPS_PART_NAME: CAP; CDS_PART_NAME: CAP_0402-A36096-114,X5R,10UF,6.3V,20%,LPDB,GENERIC; CDS_LOCATION: C10066
C10067 = CAP: CDS_PHYS_PART_NAME: CAP_0402-A36096-114,X5R,10UF,6.3V,20%,LPDB,GENERIC; OriginalSymbolOrigin: (-50,25); XY: (-1000,2525); VER: 1; ROT: 0; PHYS_PAGE: 238; LOCATION: C10067; DRAWING: @RVP1_ADL_SB_ADP_S_DDR5_SODIMM_2DPC_LIB.H55_DG2_2DPC(SCH_1):PAGE409; CDS_LIB: discrete; PCB Footprint: SMC0402IA; CHIPS_PART_NAME: CAP; CDS_PART_NAME: CAP_0402-A36096-114,X5R,10UF,6.3V,20%,LPDB,GENERIC; CDS_LOCATION: C10067
C10068 = CAP: CDS_PHYS_PART_NAME: CAP_0201-C83410-015,X5R,1UF,6.3V,10%,LPDB,GENERIC; OriginalSymbolOrigin: (-50,25); XY: (-2250,625); VER: 1; ROT: 0; PHYS_PAGE: 238; LOCATION: C10068; DRAWING: @RVP1_ADL_SB_ADP_S_DDR5_SODIMM_2DPC_LIB.H55_DG2_2DPC(SCH_1):PAGE409; CDS_LIB: discrete; PCB Footprint: SMC0201IA; CHIPS_PART_NAME: CAP; CDS_PART_NAME: CAP_0201-C83410-015,X5R,1UF,6.3V,10%,LPDB,GENERIC; CDS_LOCATION: C10068
C10069 = CAP: CDS_PHYS_PART_NAME: CAP_0201-C83410-015,X5R,1UF,6.3V,10%,LPDB,GENERIC; OriginalSymbolOrigin: (-50,25); XY: (-2225,1500); VER: 1; ROT: 0; PHYS_PAGE: 238; LOCATION: C10069; DRAWING: @RVP1_ADL_SB_ADP_S_DDR5_SODIMM_2DPC_LIB.H55_DG2_2DPC(SCH_1):PAGE409; CDS_LIB: discrete; PCB Footprint: SMC0201IA; CHIPS_PART_NAME: CAP; CDS_PART_NAME: CAP_0201-C83410-015,X5R,1UF,6.3V,10%,LPDB,GENERIC; CDS_LOCATION: C10069
C10070 = CAP: CDS_PHYS_PART_NAME: CAP_0201-C83410-015,X5R,1UF,6.3V,10%,LPDB,GENERIC; OriginalSymbolOrigin: (-50,25); XY: (-1775,625); VER: 1; ROT: 0; PHYS_PAGE: 238; LOCATION: C10070; DRAWING: @RVP1_ADL_SB_ADP_S_DDR5_SODIMM_2DPC_LIB.H55_DG2_2DPC(SCH_1):PAGE409; CDS_LIB: discrete; PCB Footprint: SMC0201IA; CHIPS_PART_NAME: CAP; CDS_PART_NAME: CAP_0201-C83410-015,X5R,1UF,6.3V,10%,LPDB,GENERIC; CDS_LOCATION: C10070
C10071 = CAP: CDS_PHYS_PART_NAME: CAP_0201-C83410-015,X5R,1UF,6.3V,10%,LPDB,GENERIC; OriginalSymbolOrigin: (-50,25); XY: (-1750,1500); VER: 1; ROT: 0; PHYS_PAGE: 238; LOCATION: C10071; DRAWING: @RVP1_ADL_SB_ADP_S_DDR5_SODIMM_2DPC_LIB.H55_DG2_2DPC(SCH_1):PAGE409; CDS_LIB: discrete; PCB Footprint: SMC0201IA; CHIPS_PART_NAME: CAP; CDS_PART_NAME: CAP_0201-C83410-015,X5R,1UF,6.3V,10%,LPDB,GENERIC; CDS_LOCATION: C10071
C10080 = CAP: CDS_PHYS_PART_NAME: CAP_0201-C83410-015,X5R,1UF,6.3V,10%,LPDB,GENERIC; OriginalSymbolOrigin: (-50,25); XY: (-1300,625); VER: 1; ROT: 0; PHYS_PAGE: 238; LOCATION: C10080; DRAWING: @RVP1_ADL_SB_ADP_S_DDR5_SODIMM_2DPC_LIB.H55_DG2_2DPC(SCH_1):PAGE409; CDS_LIB: discrete; PCB Footprint: SMC0201IA; CHIPS_PART_NAME: CAP; CDS_PART_NAME: CAP_0201-C83410-015,X5R,1UF,6.3V,10%,LPDB,GENERIC; CDS_LOCATION: C10080
C10108 = CAP: CDS_PHYS_PART_NAME: CAP_0201-C83410-015,X5R,1UF,6.3V,10%,LPDB,GENERIC; OriginalSymbolOrigin: (-50,25); XY: (-1275,1500); VER: 1; ROT: 0; PHYS_PAGE: 238; LOCATION: C10108; DRAWING: @RVP1_ADL_SB_ADP_S_DDR5_SODIMM_2DPC_LIB.H55_DG2_2DPC(SCH_1):PAGE409; CDS_LIB: discrete; PCB Footprint: SMC0201IA; CHIPS_PART_NAME: CAP; CDS_PART_NAME: CAP_0201-C83410-015,X5R,1UF,6.3V,10%,LPDB,GENERIC; CDS_LOCATION: C10108
C10109 = CAP: CDS_PHYS_PART_NAME: CAP_0201-C83410-015,X5R,1UF,6.3V,10%,LPDB,GENERIC; OriginalSymbolOrigin: (-50,25); XY: (-825,625); VER: 1; ROT: 0; PHYS_PAGE: 238; LOCATION: C10109; DRAWING: @RVP1_ADL_SB_ADP_S_DDR5_SODIMM_2DPC_LIB.H55_DG2_2DPC(SCH_1):PAGE409; CDS_LIB: discrete; PCB Footprint: SMC0201IA; CHIPS_PART_NAME: CAP; CDS_PART_NAME: CAP_0201-C83410-015,X5R,1UF,6.3V,10%,LPDB,GENERIC; CDS_LOCATION: C10109
C10110 = CAP: CDS_PHYS_PART_NAME: CAP_0201-C83410-015,X5R,1UF,6.3V,10%,LPDB,GENERIC; OriginalSymbolOrigin: (-50,25); XY: (-800,1500); VER: 1; ROT: 0; PHYS_PAGE: 238; LOCATION: C10110; DRAWING: @RVP1_ADL_SB_ADP_S_DDR5_SODIMM_2DPC_LIB.H55_DG2_2DPC(SCH_1):PAGE409; CDS_LIB: discrete; PCB Footprint: SMC0201IA; CHIPS_PART_NAME: CAP; CDS_PART_NAME: CAP_0201-C83410-015,X5R,1UF,6.3V,10%,LPDB,GENERIC; CDS_LOCATION: C10110
C10237 = CAP: CDS_PHYS_PART_NAME: CAP_0201-C83410-015,X5R,1UF,6.3V,10%,LPDB,GENERIC; OriginalSymbolOrigin: (-50,25); XY: (-7650,1500); VER: 1; ROT: 0; PHYS_PAGE: 238; LOCATION: C10237; DRAWING: @RVP1_ADL_SB_ADP_S_DDR5_SODIMM_2DPC_LIB.H55_DG2_2DPC(SCH_1):PAGE409; CDS_LIB: discrete; PCB Footprint: SMC0201IA; CHIPS_PART_NAME: CAP; CDS_PART_NAME: CAP_0201-C83410-015,X5R,1UF,6.3V,10%,LPDB,GENERIC; CDS_LOCATION: C10237
C10238 = CAP: CDS_PHYS_PART_NAME: CAP_0201-C83410-015,X5R,1UF,6.3V,10%,LPDB,GENERIC; OriginalSymbolOrigin: (-50,25); XY: (-7650,600); VER: 1; ROT: 0; PHYS_PAGE: 238; LOCATION: C10238; DRAWING: @RVP1_ADL_SB_ADP_S_DDR5_SODIMM_2DPC_LIB.H55_DG2_2DPC(SCH_1):PAGE409; CDS_LIB: discrete; PCB Footprint: SMC0201IA; CHIPS_PART_NAME: CAP; CDS_PART_NAME: CAP_0201-C83410-015,X5R,1UF,6.3V,10%,LPDB,GENERIC; CDS_LOCATION: C10238
C10239 = CAP: CDS_PHYS_PART_NAME: CAP_0201-C83410-015,X5R,1UF,6.3V,10%,LPDB,GENERIC; OriginalSymbolOrigin: (-50,25); XY: (-7200,1475); VER: 1; ROT: 0; PHYS_PAGE: 238; LOCATION: C10239; DRAWING: @RVP1_ADL_SB_ADP_S_DDR5_SODIMM_2DPC_LIB.H55_DG2_2DPC(SCH_1):PAGE409; CDS_LIB: discrete; PCB Footprint: SMC0201IA; CHIPS_PART_NAME: CAP; CDS_PART_NAME: CAP_0201-C83410-015,X5R,1UF,6.3V,10%,LPDB,GENERIC; CDS_LOCATION: C10239
C10240 = CAP: CDS_PHYS_PART_NAME: CAP_0201-C83410-015,X5R,1UF,6.3V,10%,LPDB,GENERIC; OriginalSymbolOrigin: (-50,25); XY: (-7200,575); VER: 1; ROT: 0; PHYS_PAGE: 238; LOCATION: C10240; DRAWING: @RVP1_ADL_SB_ADP_S_DDR5_SODIMM_2DPC_LIB.H55_DG2_2DPC(SCH_1):PAGE409; CDS_LIB: discrete; PCB Footprint: SMC0201IA; CHIPS_PART_NAME: CAP; CDS_PART_NAME: CAP_0201-C83410-015,X5R,1UF,6.3V,10%,LPDB,GENERIC; CDS_LOCATION: C10240
C10241 = CAP: CDS_PHYS_PART_NAME: CAP_0201-C83410-015,X5R,1UF,6.3V,10%,LPDB,GENERIC; OriginalSymbolOrigin: (-50,25); XY: (-6750,1500); VER: 1; ROT: 0; PHYS_PAGE: 238; LOCATION: C10241; DRAWING: @RVP1_ADL_SB_ADP_S_DDR5_SODIMM_2DPC_LIB.H55_DG2_2DPC(SCH_1):PAGE409; CDS_LIB: discrete; PCB Footprint: SMC0201IA; CHIPS_PART_NAME: CAP; CDS_PART_NAME: CAP_0201-C83410-015,X5R,1UF,6.3V,10%,LPDB,GENERIC; CDS_LOCATION: C10241
C10242 = CAP: CDS_PHYS_PART_NAME: CAP_0201-C83410-015,X5R,1UF,6.3V,10%,LPDB,GENERIC; OriginalSymbolOrigin: (-50,25); XY: (-6750,600); VER: 1; ROT: 0; PHYS_PAGE: 238; LOCATION: C10242; DRAWING: @RVP1_ADL_SB_ADP_S_DDR5_SODIMM_2DPC_LIB.H55_DG2_2DPC(SCH_1):PAGE409; CDS_LIB: discrete; PCB Footprint: SMC0201IA; CHIPS_PART_NAME: CAP; CDS_PART_NAME: CAP_0201-C83410-015,X5R,1UF,6.3V,10%,LPDB,GENERIC; CDS_LOCATION: C10242
C10243 = CAP: CDS_PHYS_PART_NAME: CAP_0201-C83410-015,X5R,1UF,6.3V,10%,LPDB,GENERIC; OriginalSymbolOrigin: (-50,25); XY: (-6300,1500); VER: 1; ROT: 0; PHYS_PAGE: 238; LOCATION: C10243; DRAWING: @RVP1_ADL_SB_ADP_S_DDR5_SODIMM_2DPC_LIB.H55_DG2_2DPC(SCH_1):PAGE409; CDS_LIB: discrete; PCB Footprint: SMC0201IA; CHIPS_PART_NAME: CAP; CDS_PART_NAME: CAP_0201-C83410-015,X5R,1UF,6.3V,10%,LPDB,GENERIC; CDS_LOCATION: C10243
C10244 = CAP: CDS_PHYS_PART_NAME: CAP_0201-C83410-015,X5R,1UF,6.3V,10%,LPDB,GENERIC; OriginalSymbolOrigin: (-50,25); XY: (-6300,600); VER: 1; ROT: 0; PHYS_PAGE: 238; LOCATION: C10244; DRAWING: @RVP1_ADL_SB_ADP_S_DDR5_SODIMM_2DPC_LIB.H55_DG2_2DPC(SCH_1):PAGE409; CDS_LIB: discrete; PCB Footprint: SMC0201IA; CHIPS_PART_NAME: CAP; CDS_PART_NAME: CAP_0201-C83410-015,X5R,1UF,6.3V,10%,LPDB,GENERIC; CDS_LOCATION: C10244
C10245 = CAP: CDS_PHYS_PART_NAME: CAP_0201-C83410-015,X5R,1UF,6.3V,10%,LPDB,GENERIC; OriginalSymbolOrigin: (-50,25); XY: (-5850,1500); VER: 1; ROT: 0; PHYS_PAGE: 238; LOCATION: C10245; DRAWING: @RVP1_ADL_SB_ADP_S_DDR5_SODIMM_2DPC_LIB.H55_DG2_2DPC(SCH_1):PAGE409; CDS_LIB: discrete; PCB Footprint: SMC0201IA; CHIPS_PART_NAME: CAP; CDS_PART_NAME: CAP_0201-C83410-015,X5R,1UF,6.3V,10%,LPDB,GENERIC; CDS_LOCATION: C10245
C10246 = CAP: CDS_PHYS_PART_NAME: CAP_0201-C83410-015,X5R,1UF,6.3V,10%,LPDB,GENERIC; OriginalSymbolOrigin: (-50,25); XY: (-5850,600); VER: 1; ROT: 0; PHYS_PAGE: 238; LOCATION: C10246; DRAWING: @RVP1_ADL_SB_ADP_S_DDR5_SODIMM_2DPC_LIB.H55_DG2_2DPC(SCH_1):PAGE409; CDS_LIB: discrete; PCB Footprint: SMC0201IA; CHIPS_PART_NAME: CAP; CDS_PART_NAME: CAP_0201-C83410-015,X5R,1UF,6.3V,10%,LPDB,GENERIC; CDS_LOCATION: C10246
C10247 = CAP: CDS_PHYS_PART_NAME: CAP_0201-C83410-015,X5R,1UF,6.3V,10%,LPDB,GENERIC; OriginalSymbolOrigin: (-50,25); XY: (-5400,1500); VER: 1; ROT: 0; PHYS_PAGE: 238; LOCATION: C10247; DRAWING: @RVP1_ADL_SB_ADP_S_DDR5_SODIMM_2DPC_LIB.H55_DG2_2DPC(SCH_1):PAGE409; CDS_LIB: discrete; PCB Footprint: SMC0201IA; CHIPS_PART_NAME: CAP; CDS_PART_NAME: CAP_0201-C83410-015,X5R,1UF,6.3V,10%,LPDB,GENERIC; CDS_LOCATION: C10247
C10248 = CAP: CDS_PHYS_PART_NAME: CAP_0201-C83410-015,X5R,1UF,6.3V,10%,LPDB,GENERIC; OriginalSymbolOrigin: (-50,25); XY: (-5400,600); VER: 1; ROT: 0; PHYS_PAGE: 238; LOCATION: C10248; DRAWING: @RVP1_ADL_SB_ADP_S_DDR5_SODIMM_2DPC_LIB.H55_DG2_2DPC(SCH_1):PAGE409; CDS_LIB: discrete; PCB Footprint: SMC0201IA; CHIPS_PART_NAME: CAP; CDS_PART_NAME: CAP_0201-C83410-015,X5R,1UF,6.3V,10%,LPDB,GENERIC; CDS_LOCATION: C10248
C10249 = CAP: CDS_PHYS_PART_NAME: CAP_0201-C83410-015,X5R,1UF,6.3V,10%,LPDB,GENERIC; OriginalSymbolOrigin: (-50,25); XY: (-4950,1475); VER: 1; ROT: 0; PHYS_PAGE: 238; LOCATION: C10249; DRAWING: @RVP1_ADL_SB_ADP_S_DDR5_SODIMM_2DPC_LIB.H55_DG2_2DPC(SCH_1):PAGE409; CDS_LIB: discrete; PCB Footprint: SMC0201IA; CHIPS_PART_NAME: CAP; CDS_PART_NAME: CAP_0201-C83410-015,X5R,1UF,6.3V,10%,LPDB,GENERIC; CDS_LOCATION: C10249
C10250 = CAP: CDS_PHYS_PART_NAME: CAP_0201-C83410-015,X5R,1UF,6.3V,10%,LPDB,GENERIC; OriginalSymbolOrigin: (-50,25); XY: (-4950,575); VER: 1; ROT: 0; PHYS_PAGE: 238; LOCATION: C10250; DRAWING: @RVP1_ADL_SB_ADP_S_DDR5_SODIMM_2DPC_LIB.H55_DG2_2DPC(SCH_1):PAGE409; CDS_LIB: discrete; PCB Footprint: SMC0201IA; CHIPS_PART_NAME: CAP; CDS_PART_NAME: CAP_0201-C83410-015,X5R,1UF,6.3V,10%,LPDB,GENERIC; CDS_LOCATION: C10250
C10251 = CAP: CDS_PHYS_PART_NAME: CAP_0201-C83410-015,X5R,1UF,6.3V,10%,LPDB,GENERIC; OriginalSymbolOrigin: (-50,25); XY: (-4500,1500); VER: 1; ROT: 0; PHYS_PAGE: 238; LOCATION: C10251; DRAWING: @RVP1_ADL_SB_ADP_S_DDR5_SODIMM_2DPC_LIB.H55_DG2_2DPC(SCH_1):PAGE409; CDS_LIB: discrete; PCB Footprint: SMC0201IA; CHIPS_PART_NAME: CAP; CDS_PART_NAME: CAP_0201-C83410-015,X5R,1UF,6.3V,10%,LPDB,GENERIC; CDS_LOCATION: C10251
C10252 = CAP: CDS_PHYS_PART_NAME: CAP_0201-C83410-015,X5R,1UF,6.3V,10%,LPDB,GENERIC; OriginalSymbolOrigin: (-50,25); XY: (-4500,600); VER: 1; ROT: 0; PHYS_PAGE: 238; LOCATION: C10252; DRAWING: @RVP1_ADL_SB_ADP_S_DDR5_SODIMM_2DPC_LIB.H55_DG2_2DPC(SCH_1):PAGE409; CDS_LIB: discrete; PCB Footprint: SMC0201IA; CHIPS_PART_NAME: CAP; CDS_PART_NAME: CAP_0201-C83410-015,X5R,1UF,6.3V,10%,LPDB,GENERIC; CDS_LOCATION: C10252
C10253 = CAP: CDS_PHYS_PART_NAME: CAP_0201-C83410-015,X5R,1UF,6.3V,10%,LPDB,GENERIC; OriginalSymbolOrigin: (-50,25); XY: (-4050,1500); VER: 1; ROT: 0; PHYS_PAGE: 238; LOCATION: C10253; DRAWING: @RVP1_ADL_SB_ADP_S_DDR5_SODIMM_2DPC_LIB.H55_DG2_2DPC(SCH_1):PAGE409; CDS_LIB: discrete; PCB Footprint: SMC0201IA; CHIPS_PART_NAME: CAP; CDS_PART_NAME: CAP_0201-C83410-015,X5R,1UF,6.3V,10%,LPDB,GENERIC; CDS_LOCATION: C10253
C10254 = CAP: CDS_PHYS_PART_NAME: CAP_0201-C83410-015,X5R,1UF,6.3V,10%,LPDB,GENERIC; OriginalSymbolOrigin: (-50,25); XY: (-4075,600); VER: 1; ROT: 0; PHYS_PAGE: 238; LOCATION: C10254; DRAWING: @RVP1_ADL_SB_ADP_S_DDR5_SODIMM_2DPC_LIB.H55_DG2_2DPC(SCH_1):PAGE409; CDS_LIB: discrete; PCB Footprint: SMC0201IA; CHIPS_PART_NAME: CAP; CDS_PART_NAME: CAP_0201-C83410-015,X5R,1UF,6.3V,10%,LPDB,GENERIC; CDS_LOCATION: C10254
C10255 = CAP: CDS_PHYS_PART_NAME: CAP_0201-C83410-015,X5R,1UF,6.3V,10%,LPDB,GENERIC; OriginalSymbolOrigin: (-50,25); XY: (-3600,1500); VER: 1; ROT: 0; PHYS_PAGE: 238; LOCATION: C10255; DRAWING: @RVP1_ADL_SB_ADP_S_DDR5_SODIMM_2DPC_LIB.H55_DG2_2DPC(SCH_1):PAGE409; CDS_LIB: discrete; PCB Footprint: SMC0201IA; CHIPS_PART_NAME: CAP; CDS_PART_NAME: CAP_0201-C83410-015,X5R,1UF,6.3V,10%,LPDB,GENERIC; CDS_LOCATION: C10255
C10256 = CAP: CDS_PHYS_PART_NAME: CAP_0201-C83410-015,X5R,1UF,6.3V,10%,LPDB,GENERIC; OriginalSymbolOrigin: (-50,25); XY: (-3625,600); VER: 1; ROT: 0; PHYS_PAGE: 238; LOCATION: C10256; DRAWING: @RVP1_ADL_SB_ADP_S_DDR5_SODIMM_2DPC_LIB.H55_DG2_2DPC(SCH_1):PAGE409; CDS_LIB: discrete; PCB Footprint: SMC0201IA; CHIPS_PART_NAME: CAP; CDS_PART_NAME: CAP_0201-C83410-015,X5R,1UF,6.3V,10%,LPDB,GENERIC; CDS_LOCATION: C10256
C10257 = CAP: CDS_PHYS_PART_NAME: CAP_0201-C83410-015,X5R,1UF,6.3V,10%,LPDB,GENERIC; OriginalSymbolOrigin: (-50,25); XY: (-3150,1475); VER: 1; ROT: 0; PHYS_PAGE: 238; LOCATION: C10257; DRAWING: @RVP1_ADL_SB_ADP_S_DDR5_SODIMM_2DPC_LIB.H55_DG2_2DPC(SCH_1):PAGE409; CDS_LIB: discrete; PCB Footprint: SMC0201IA; CHIPS_PART_NAME: CAP; CDS_PART_NAME: CAP_0201-C83410-015,X5R,1UF,6.3V,10%,LPDB,GENERIC; CDS_LOCATION: C10257
C10258 = CAP: CDS_PHYS_PART_NAME: CAP_0201-C83410-015,X5R,1UF,6.3V,10%,LPDB,GENERIC; OriginalSymbolOrigin: (-50,25); XY: (-3175,600); VER: 1; ROT: 0; PHYS_PAGE: 238; LOCATION: C10258; DRAWING: @RVP1_ADL_SB_ADP_S_DDR5_SODIMM_2DPC_LIB.H55_DG2_2DPC(SCH_1):PAGE409; CDS_LIB: discrete; PCB Footprint: SMC0201IA; CHIPS_PART_NAME: CAP; CDS_PART_NAME: CAP_0201-C83410-015,X5R,1UF,6.3V,10%,LPDB,GENERIC; CDS_LOCATION: C10258
C10259 = CAP: CDS_PHYS_PART_NAME: CAP_0201-C83410-015,X5R,1UF,6.3V,10%,LPDB,GENERIC; OriginalSymbolOrigin: (-50,25); XY: (-2700,1500); VER: 1; ROT: 0; PHYS_PAGE: 238; LOCATION: C10259; DRAWING: @RVP1_ADL_SB_ADP_S_DDR5_SODIMM_2DPC_LIB.H55_DG2_2DPC(SCH_1):PAGE409; CDS_LIB: discrete; PCB Footprint: SMC0201IA; CHIPS_PART_NAME: CAP; CDS_PART_NAME: CAP_0201-C83410-015,X5R,1UF,6.3V,10%,LPDB,GENERIC; CDS_LOCATION: C10259
C10260 = CAP: CDS_PHYS_PART_NAME: CAP_0201-C83410-015,X5R,1UF,6.3V,10%,LPDB,GENERIC; OriginalSymbolOrigin: (-50,25); XY: (-2725,600); VER: 1; ROT: 0; PHYS_PAGE: 238; LOCATION: C10260; DRAWING: @RVP1_ADL_SB_ADP_S_DDR5_SODIMM_2DPC_LIB.H55_DG2_2DPC(SCH_1):PAGE409; CDS_LIB: discrete; PCB Footprint: SMC0201IA; CHIPS_PART_NAME: CAP; CDS_PART_NAME: CAP_0201-C83410-015,X5R,1UF,6.3V,10%,LPDB,GENERIC; CDS_LOCATION: C10260
C10633 = CAP: CDS_PHYS_PART_NAME: CAP_0402-A36096-114,X5R,10UF,6.3V,20%,LPDB,GENERIC; OriginalSymbolOrigin: (-50,25); XY: (-7625,3300); VER: 1; ROT: 0; PHYS_PAGE: 238; LOCATION: C10633; DRAWING: @RVP1_ADL_SB_ADP_S_DDR5_SODIMM_2DPC_LIB.H55_DG2_2DPC(SCH_1):PAGE409; CDS_LIB: discrete; PCB Footprint: SMC0402IA; CHIPS_PART_NAME: CAP; CDS_PART_NAME: CAP_0402-A36096-114,X5R,10UF,6.3V,20%,LPDB,GENERIC; CDS_LOCATION: C10633
C10634 = CAP: CDS_PHYS_PART_NAME: CAP_0402-A36096-114,X5R,10UF,6.3V,20%,LPDB,GENERIC; OriginalSymbolOrigin: (-50,25); XY: (-7650,2500); VER: 1; ROT: 0; PHYS_PAGE: 238; LOCATION: C10634; DRAWING: @RVP1_ADL_SB_ADP_S_DDR5_SODIMM_2DPC_LIB.H55_DG2_2DPC(SCH_1):PAGE409; CDS_LIB: discrete; PCB Footprint: SMC0402IA; CHIPS_PART_NAME: CAP; CDS_PART_NAME: CAP_0402-A36096-114,X5R,10UF,6.3V,20%,LPDB,GENERIC; CDS_LOCATION: C10634
C10635 = CAP: CDS_PHYS_PART_NAME: CAP_0402-A36096-114,X5R,10UF,6.3V,20%,LPDB,GENERIC; OriginalSymbolOrigin: (-50,25); XY: (-7175,3300); VER: 1; ROT: 0; PHYS_PAGE: 238; LOCATION: C10635; DRAWING: @RVP1_ADL_SB_ADP_S_DDR5_SODIMM_2DPC_LIB.H55_DG2_2DPC(SCH_1):PAGE409; CDS_LIB: discrete; PCB Footprint: SMC0402IA; CHIPS_PART_NAME: CAP; CDS_PART_NAME: CAP_0402-A36096-114,X5R,10UF,6.3V,20%,LPDB,GENERIC; CDS_LOCATION: C10635
C10636 = CAP: CDS_PHYS_PART_NAME: CAP_0402-A36096-114,X5R,10UF,6.3V,20%,LPDB,GENERIC; OriginalSymbolOrigin: (-50,25); XY: (-7200,2500); VER: 1; ROT: 0; PHYS_PAGE: 238; LOCATION: C10636; DRAWING: @RVP1_ADL_SB_ADP_S_DDR5_SODIMM_2DPC_LIB.H55_DG2_2DPC(SCH_1):PAGE409; CDS_LIB: discrete; PCB Footprint: SMC0402IA; CHIPS_PART_NAME: CAP; CDS_PART_NAME: CAP_0402-A36096-114,X5R,10UF,6.3V,20%,LPDB,GENERIC; CDS_LOCATION: C10636
C10637 = CAP: CDS_PHYS_PART_NAME: CAP_0402-A36096-114,X5R,10UF,6.3V,20%,LPDB,GENERIC; OriginalSymbolOrigin: (-50,25); XY: (-6725,3300); VER: 1; ROT: 0; PHYS_PAGE: 238; LOCATION: C10637; DRAWING: @RVP1_ADL_SB_ADP_S_DDR5_SODIMM_2DPC_LIB.H55_DG2_2DPC(SCH_1):PAGE409; CDS_LIB: discrete; PCB Footprint: SMC0402IA; CHIPS_PART_NAME: CAP; CDS_PART_NAME: CAP_0402-A36096-114,X5R,10UF,6.3V,20%,LPDB,GENERIC; CDS_LOCATION: C10637
C10638 = CAP: CDS_PHYS_PART_NAME: CAP_0402-A36096-114,X5R,10UF,6.3V,20%,LPDB,GENERIC; OriginalSymbolOrigin: (-50,25); XY: (-6750,2500); VER: 1; ROT: 0; PHYS_PAGE: 238; LOCATION: C10638; DRAWING: @RVP1_ADL_SB_ADP_S_DDR5_SODIMM_2DPC_LIB.H55_DG2_2DPC(SCH_1):PAGE409; CDS_LIB: discrete; PCB Footprint: SMC0402IA; CHIPS_PART_NAME: CAP; CDS_PART_NAME: CAP_0402-A36096-114,X5R,10UF,6.3V,20%,LPDB,GENERIC; CDS_LOCATION: C10638
C10639 = CAP: CDS_PHYS_PART_NAME: CAP_0402-A36096-114,X5R,10UF,6.3V,20%,LPDB,GENERIC; OriginalSymbolOrigin: (-50,25); XY: (-6275,3300); VER: 1; ROT: 0; PHYS_PAGE: 238; LOCATION: C10639; DRAWING: @RVP1_ADL_SB_ADP_S_DDR5_SODIMM_2DPC_LIB.H55_DG2_2DPC(SCH_1):PAGE409; CDS_LIB: discrete; PCB Footprint: SMC0402IA; CHIPS_PART_NAME: CAP; CDS_PART_NAME: CAP_0402-A36096-114,X5R,10UF,6.3V,20%,LPDB,GENERIC; CDS_LOCATION: C10639
C10640 = CAP: CDS_PHYS_PART_NAME: CAP_0402-A36096-114,X5R,10UF,6.3V,20%,LPDB,GENERIC; OriginalSymbolOrigin: (-50,25); XY: (-6300,2500); VER: 1; ROT: 0; PHYS_PAGE: 238; LOCATION: C10640; DRAWING: @RVP1_ADL_SB_ADP_S_DDR5_SODIMM_2DPC_LIB.H55_DG2_2DPC(SCH_1):PAGE409; CDS_LIB: discrete; PCB Footprint: SMC0402IA; CHIPS_PART_NAME: CAP; CDS_PART_NAME: CAP_0402-A36096-114,X5R,10UF,6.3V,20%,LPDB,GENERIC; CDS_LOCATION: C10640
C10641 = CAP: CDS_PHYS_PART_NAME: CAP_0402-A36096-114,X5R,10UF,6.3V,20%,LPDB,GENERIC; OriginalSymbolOrigin: (-50,25); XY: (-5825,3300); VER: 1; ROT: 0; PHYS_PAGE: 238; LOCATION: C10641; DRAWING: @RVP1_ADL_SB_ADP_S_DDR5_SODIMM_2DPC_LIB.H55_DG2_2DPC(SCH_1):PAGE409; CDS_LIB: discrete; PCB Footprint: SMC0402IA; CHIPS_PART_NAME: CAP; CDS_PART_NAME: CAP_0402-A36096-114,X5R,10UF,6.3V,20%,LPDB,GENERIC; CDS_LOCATION: C10641
C10642 = CAP: CDS_PHYS_PART_NAME: CAP_0402-A36096-114,X5R,10UF,6.3V,20%,LPDB,GENERIC; OriginalSymbolOrigin: (-50,25); XY: (-5850,2500); VER: 1; ROT: 0; PHYS_PAGE: 238; LOCATION: C10642; DRAWING: @RVP1_ADL_SB_ADP_S_DDR5_SODIMM_2DPC_LIB.H55_DG2_2DPC(SCH_1):PAGE409; CDS_LIB: discrete; PCB Footprint: SMC0402IA; CHIPS_PART_NAME: CAP; CDS_PART_NAME: CAP_0402-A36096-114,X5R,10UF,6.3V,20%,LPDB,GENERIC; CDS_LOCATION: C10642
C10643 = CAP: CDS_PHYS_PART_NAME: CAP_0402-A36096-114,X5R,10UF,6.3V,20%,LPDB,GENERIC; OriginalSymbolOrigin: (-50,25); XY: (-5375,3300); VER: 1; ROT: 0; PHYS_PAGE: 238; LOCATION: C10643; DRAWING: @RVP1_ADL_SB_ADP_S_DDR5_SODIMM_2DPC_LIB.H55_DG2_2DPC(SCH_1):PAGE409; CDS_LIB: discrete; PCB Footprint: SMC0402IA; CHIPS_PART_NAME: CAP; CDS_PART_NAME: CAP_0402-A36096-114,X5R,10UF,6.3V,20%,LPDB,GENERIC; CDS_LOCATION: C10643
C10644 = CAP: CDS_PHYS_PART_NAME: CAP_0402-A36096-114,X5R,10UF,6.3V,20%,LPDB,GENERIC; OriginalSymbolOrigin: (-50,25); XY: (-5400,2500); VER: 1; ROT: 0; PHYS_PAGE: 238; LOCATION: C10644; DRAWING: @RVP1_ADL_SB_ADP_S_DDR5_SODIMM_2DPC_LIB.H55_DG2_2DPC(SCH_1):PAGE409; CDS_LIB: discrete; PCB Footprint: SMC0402IA; CHIPS_PART_NAME: CAP; CDS_PART_NAME: CAP_0402-A36096-114,X5R,10UF,6.3V,20%,LPDB,GENERIC; CDS_LOCATION: C10644
C10646 = CAP: CDS_PHYS_PART_NAME: CAP_0402-A36096-114,X5R,10UF,6.3V,20%,LPDB,GENERIC; OriginalSymbolOrigin: (-50,25); XY: (-4950,2500); VER: 1; ROT: 0; PHYS_PAGE: 238; LOCATION: C10646; DRAWING: @RVP1_ADL_SB_ADP_S_DDR5_SODIMM_2DPC_LIB.H55_DG2_2DPC(SCH_1):PAGE409; CDS_LIB: discrete; PCB Footprint: SMC0402IA; CHIPS_PART_NAME: CAP; CDS_PART_NAME: CAP_0402-A36096-114,X5R,10UF,6.3V,20%,LPDB,GENERIC; CDS_LOCATION: C10646
C10647 = CAP: CDS_PHYS_PART_NAME: CAP_0402-A36096-114,X5R,10UF,6.3V,20%,LPDB,GENERIC; OriginalSymbolOrigin: (-50,25); XY: (-4950,3300); VER: 1; ROT: 0; PHYS_PAGE: 238; LOCATION: C10647; DRAWING: @RVP1_ADL_SB_ADP_S_DDR5_SODIMM_2DPC_LIB.H55_DG2_2DPC(SCH_1):PAGE409; CDS_LIB: discrete; PCB Footprint: SMC0402IA; CHIPS_PART_NAME: CAP; CDS_PART_NAME: CAP_0402-A36096-114,X5R,10UF,6.3V,20%,LPDB,GENERIC; CDS_LOCATION: C10647
C10648 = CAP: CDS_PHYS_PART_NAME: CAP_0402-A36096-114,X5R,10UF,6.3V,20%,LPDB,GENERIC; OriginalSymbolOrigin: (-50,25); XY: (-4500,2500); VER: 1; ROT: 0; PHYS_PAGE: 238; LOCATION: C10648; DRAWING: @RVP1_ADL_SB_ADP_S_DDR5_SODIMM_2DPC_LIB.H55_DG2_2DPC(SCH_1):PAGE409; CDS_LIB: discrete; PCB Footprint: SMC0402IA; CHIPS_PART_NAME: CAP; CDS_PART_NAME: CAP_0402-A36096-114,X5R,10UF,6.3V,20%,LPDB,GENERIC; CDS_LOCATION: C10648
C10649 = CAP: CDS_PHYS_PART_NAME: CAP_0402-A36096-114,X5R,10UF,6.3V,20%,LPDB,GENERIC; OriginalSymbolOrigin: (-50,25); XY: (-4500,3300); VER: 1; ROT: 0; PHYS_PAGE: 238; LOCATION: C10649; DRAWING: @RVP1_ADL_SB_ADP_S_DDR5_SODIMM_2DPC_LIB.H55_DG2_2DPC(SCH_1):PAGE409; CDS_LIB: discrete; PCB Footprint: SMC0402IA; CHIPS_PART_NAME: CAP; CDS_PART_NAME: CAP_0402-A36096-114,X5R,10UF,6.3V,20%,LPDB,GENERIC; CDS_LOCATION: C10649
C10650 = CAP: CDS_PHYS_PART_NAME: CAP_0402-A36096-114,X5R,10UF,6.3V,20%,LPDB,GENERIC; OriginalSymbolOrigin: (-50,25); XY: (-4050,2525); VER: 1; ROT: 0; PHYS_PAGE: 238; LOCATION: C10650; DRAWING: @RVP1_ADL_SB_ADP_S_DDR5_SODIMM_2DPC_LIB.H55_DG2_2DPC(SCH_1):PAGE409; CDS_LIB: discrete; PCB Footprint: SMC0402IA; CHIPS_PART_NAME: CAP; CDS_PART_NAME: CAP_0402-A36096-114,X5R,10UF,6.3V,20%,LPDB,GENERIC; CDS_LOCATION: C10650
C10651 = CAP: CDS_PHYS_PART_NAME: CAP_0402-A36096-114,X5R,10UF,6.3V,20%,LPDB,GENERIC; OriginalSymbolOrigin: (-50,25); XY: (-4050,3300); VER: 1; ROT: 0; PHYS_PAGE: 238; LOCATION: C10651; DRAWING: @RVP1_ADL_SB_ADP_S_DDR5_SODIMM_2DPC_LIB.H55_DG2_2DPC(SCH_1):PAGE409; CDS_LIB: discrete; PCB Footprint: SMC0402IA; CHIPS_PART_NAME: CAP; CDS_PART_NAME: CAP_0402-A36096-114,X5R,10UF,6.3V,20%,LPDB,GENERIC; CDS_LOCATION: C10651
C10652 = CAP: CDS_PHYS_PART_NAME: CAP_0402-A36096-114,X5R,10UF,6.3V,20%,LPDB,GENERIC; OriginalSymbolOrigin: (-50,25); XY: (-3600,2500); VER: 1; ROT: 0; PHYS_PAGE: 238; LOCATION: C10652; DRAWING: @RVP1_ADL_SB_ADP_S_DDR5_SODIMM_2DPC_LIB.H55_DG2_2DPC(SCH_1):PAGE409; CDS_LIB: discrete; PCB Footprint: SMC0402IA; CHIPS_PART_NAME: CAP; CDS_PART_NAME: CAP_0402-A36096-114,X5R,10UF,6.3V,20%,LPDB,GENERIC; CDS_LOCATION: C10652
C10653 = CAP: CDS_PHYS_PART_NAME: CAP_0402-A36096-114,X5R,10UF,6.3V,20%,LPDB,GENERIC; OriginalSymbolOrigin: (-50,25); XY: (-3600,3300); VER: 1; ROT: 0; PHYS_PAGE: 238; LOCATION: C10653; DRAWING: @RVP1_ADL_SB_ADP_S_DDR5_SODIMM_2DPC_LIB.H55_DG2_2DPC(SCH_1):PAGE409; CDS_LIB: discrete; PCB Footprint: SMC0402IA; CHIPS_PART_NAME: CAP; CDS_PART_NAME: CAP_0402-A36096-114,X5R,10UF,6.3V,20%,LPDB,GENERIC; CDS_LOCATION: C10653
C10654 = CAP: CDS_PHYS_PART_NAME: CAP_0402-A36096-114,X5R,10UF,6.3V,20%,LPDB,GENERIC; OriginalSymbolOrigin: (-50,25); XY: (-3150,2500); VER: 1; ROT: 0; PHYS_PAGE: 238; LOCATION: C10654; DRAWING: @RVP1_ADL_SB_ADP_S_DDR5_SODIMM_2DPC_LIB.H55_DG2_2DPC(SCH_1):PAGE409; CDS_LIB: discrete; PCB Footprint: SMC0402IA; CHIPS_PART_NAME: CAP; CDS_PART_NAME: CAP_0402-A36096-114,X5R,10UF,6.3V,20%,LPDB,GENERIC; CDS_LOCATION: C10654
C10655 = CAP: CDS_PHYS_PART_NAME: CAP_0402-A36096-114,X5R,10UF,6.3V,20%,LPDB,GENERIC; OriginalSymbolOrigin: (-50,25); XY: (-3150,3300); VER: 1; ROT: 0; PHYS_PAGE: 238; LOCATION: C10655; DRAWING: @RVP1_ADL_SB_ADP_S_DDR5_SODIMM_2DPC_LIB.H55_DG2_2DPC(SCH_1):PAGE409; CDS_LIB: discrete; PCB Footprint: SMC0402IA; CHIPS_PART_NAME: CAP; CDS_PART_NAME: CAP_0402-A36096-114,X5R,10UF,6.3V,20%,LPDB,GENERIC; CDS_LOCATION: C10655
C10656 = CAP: CDS_PHYS_PART_NAME: CAP_0402-A36096-114,X5R,10UF,6.3V,20%,LPDB,GENERIC; OriginalSymbolOrigin: (-50,25); XY: (-2700,2500); VER: 1; ROT: 0; PHYS_PAGE: 238; LOCATION: C10656; DRAWING: @RVP1_ADL_SB_ADP_S_DDR5_SODIMM_2DPC_LIB.H55_DG2_2DPC(SCH_1):PAGE409; CDS_LIB: discrete; PCB Footprint: SMC0402IA; CHIPS_PART_NAME: CAP; CDS_PART_NAME: CAP_0402-A36096-114,X5R,10UF,6.3V,20%,LPDB,GENERIC; CDS_LOCATION: C10656
C10657 = CAP: CDS_PHYS_PART_NAME: CAP_0402-A36096-114,X5R,10UF,6.3V,20%,LPDB,GENERIC; OriginalSymbolOrigin: (-50,25); XY: (-2700,3300); VER: 1; ROT: 0; PHYS_PAGE: 238; LOCATION: C10657; DRAWING: @RVP1_ADL_SB_ADP_S_DDR5_SODIMM_2DPC_LIB.H55_DG2_2DPC(SCH_1):PAGE409; CDS_LIB: discrete; PCB Footprint: SMC0402IA; CHIPS_PART_NAME: CAP; CDS_PART_NAME: CAP_0402-A36096-114,X5R,10UF,6.3V,20%,LPDB,GENERIC; CDS_LOCATION: C10657
C10714 = CAP: CDS_PHYS_PART_NAME: CAP_0603-602433-081,X5R,22UF,6.3V,20%,LPDB,GENERIC; OriginalSymbolOrigin: (-50,25); XY: (-7600,4250); VER: 1; ROT: 0; PHYS_PAGE: 238; LOCATION: C10714; DRAWING: @RVP1_ADL_SB_ADP_S_DDR5_SODIMM_2DPC_LIB.H55_DG2_2DPC(SCH_1):PAGE409; CDS_LIB: discrete; PCB Footprint: SMC0603ID; CHIPS_PART_NAME: CAP; CDS_PART_NAME: CAP_0603-602433-081,X5R,22UF,6.3V,20%,LPDB,GENERIC; CDS_LOCATION: C10714
C10716 = CAP: CDS_PHYS_PART_NAME: CAP_0603-602433-081,X5R,22UF,6.3V,20%,LPDB,GENERIC; OriginalSymbolOrigin: (-50,25); XY: (-7150,4250); VER: 1; ROT: 0; PHYS_PAGE: 238; LOCATION: C10716; DRAWING: @RVP1_ADL_SB_ADP_S_DDR5_SODIMM_2DPC_LIB.H55_DG2_2DPC(SCH_1):PAGE409; CDS_LIB: discrete; PCB Footprint: SMC0603ID; CHIPS_PART_NAME: CAP; CDS_PART_NAME: CAP_0603-602433-081,X5R,22UF,6.3V,20%,LPDB,GENERIC; CDS_LOCATION: C10716
C10717 = CAP: CDS_PHYS_PART_NAME: CAP_0603-602433-081,X5R,22UF,6.3V,20%,LPDB,GENERIC; OriginalSymbolOrigin: (-50,25); XY: (-6700,4250); VER: 1; ROT: 0; PHYS_PAGE: 238; LOCATION: C10717; DRAWING: @RVP1_ADL_SB_ADP_S_DDR5_SODIMM_2DPC_LIB.H55_DG2_2DPC(SCH_1):PAGE409; CDS_LIB: discrete; PCB Footprint: SMC0603ID; CHIPS_PART_NAME: CAP; CDS_PART_NAME: CAP_0603-602433-081,X5R,22UF,6.3V,20%,LPDB,GENERIC; CDS_LOCATION: C10717
C10718 = CAP: CDS_PHYS_PART_NAME: CAP_0603-602433-081,X5R,22UF,6.3V,20%,LPDB,GENERIC; OriginalSymbolOrigin: (-50,25); XY: (-6250,4250); VER: 1; ROT: 0; PHYS_PAGE: 238; LOCATION: C10718; DRAWING: @RVP1_ADL_SB_ADP_S_DDR5_SODIMM_2DPC_LIB.H55_DG2_2DPC(SCH_1):PAGE409; CDS_LIB: discrete; PCB Footprint: SMC0603ID; CHIPS_PART_NAME: CAP; CDS_PART_NAME: CAP_0603-602433-081,X5R,22UF,6.3V,20%,LPDB,GENERIC; CDS_LOCATION: C10718
C10719 = CAP: CDS_PHYS_PART_NAME: CAP_0603-602433-081,X5R,22UF,6.3V,20%,LPDB,GENERIC; OriginalSymbolOrigin: (-50,25); XY: (-5800,4250); VER: 1; ROT: 0; PHYS_PAGE: 238; LOCATION: C10719; DRAWING: @RVP1_ADL_SB_ADP_S_DDR5_SODIMM_2DPC_LIB.H55_DG2_2DPC(SCH_1):PAGE409; CDS_LIB: discrete; PCB Footprint: SMC0603ID; CHIPS_PART_NAME: CAP; CDS_PART_NAME: CAP_0603-602433-081,X5R,22UF,6.3V,20%,LPDB,GENERIC; CDS_LOCATION: C10719
C10720 = CAP: CDS_PHYS_PART_NAME: CAP_0603-602433-081,X5R,22UF,6.3V,20%,LPDB,GENERIC; OriginalSymbolOrigin: (-50,25); XY: (-5350,4250); VER: 1; ROT: 0; PHYS_PAGE: 238; LOCATION: C10720; DRAWING: @RVP1_ADL_SB_ADP_S_DDR5_SODIMM_2DPC_LIB.H55_DG2_2DPC(SCH_1):PAGE409; CDS_LIB: discrete; PCB Footprint: SMC0603ID; CHIPS_PART_NAME: CAP; CDS_PART_NAME: CAP_0603-602433-081,X5R,22UF,6.3V,20%,LPDB,GENERIC; CDS_LOCATION: C10720
C10721 = CAP: CDS_PHYS_PART_NAME: CAP_0603-602433-081,X5R,22UF,6.3V,20%,LPDB,GENERIC; OriginalSymbolOrigin: (-50,25); XY: (-4900,4250); VER: 1; ROT: 0; PHYS_PAGE: 238; LOCATION: C10721; DRAWING: @RVP1_ADL_SB_ADP_S_DDR5_SODIMM_2DPC_LIB.H55_DG2_2DPC(SCH_1):PAGE409; CDS_LIB: discrete; PCB Footprint: SMC0603ID; CHIPS_PART_NAME: CAP; CDS_PART_NAME: CAP_0603-602433-081,X5R,22UF,6.3V,20%,LPDB,GENERIC; CDS_LOCATION: C10721
C10722 = CAP: CDS_PHYS_PART_NAME: CAP_0603-602433-081,X5R,22UF,6.3V,20%,LPDB,GENERIC; OriginalSymbolOrigin: (-50,25); XY: (-4425,4250); VER: 1; ROT: 0; PHYS_PAGE: 238; LOCATION: C10722; DRAWING: @RVP1_ADL_SB_ADP_S_DDR5_SODIMM_2DPC_LIB.H55_DG2_2DPC(SCH_1):PAGE409; CDS_LIB: discrete; PCB Footprint: SMC0603ID; CHIPS_PART_NAME: CAP; CDS_PART_NAME: CAP_0603-602433-081,X5R,22UF,6.3V,20%,LPDB,GENERIC; CDS_LOCATION: C10722
C23801 = CAP: CDS_PHYS_PART_NAME: CAP_0603-602433-081,X5R,22UF,6.3V,20%,LPDB,GENERIC; OriginalSymbolOrigin: (-50,25); XY: (-3975,4250); VER: 1; ROT: 0; PHYS_PAGE: 238; LOCATION: C23801; DRAWING: @RVP1_ADL_SB_ADP_S_DDR5_SODIMM_2DPC_LIB.H55_DG2_2DPC(SCH_1):PAGE409; CDS_LIB: discrete; PCB Footprint: SMC0603ID; CHIPS_PART_NAME: CAP; CDS_PART_NAME: CAP_0603-602433-081,X5R,22UF,6.3V,20%,LPDB,GENERIC; CDS_LOCATION: C23801
C23802 = CAP: CDS_PHYS_PART_NAME: CAP_0603-602433-081,X5R,22UF,6.3V,20%,LPDB,GENERIC; OriginalSymbolOrigin: (-50,25); XY: (-3525,4250); VER: 1; ROT: 0; PHYS_PAGE: 238; LOCATION: C23802; DRAWING: @RVP1_ADL_SB_ADP_S_DDR5_SODIMM_2DPC_LIB.H55_DG2_2DPC(SCH_1):PAGE409; CDS_LIB: discrete; PCB Footprint: SMC0603ID; CHIPS_PART_NAME: CAP; CDS_PART_NAME: CAP_0603-602433-081,X5R,22UF,6.3V,20%,LPDB,GENERIC; CDS_LOCATION: C23802
C23803 = CAP: CDS_PHYS_PART_NAME: CAP_0603-602433-081,X5R,22UF,6.3V,20%,LPDB,GENERIC; OriginalSymbolOrigin: (-50,25); XY: (-3075,4250); VER: 1; ROT: 0; PHYS_PAGE: 238; LOCATION: C23803; DRAWING: @RVP1_ADL_SB_ADP_S_DDR5_SODIMM_2DPC_LIB.H55_DG2_2DPC(SCH_1):PAGE409; CDS_LIB: discrete; PCB Footprint: SMC0603ID; CHIPS_PART_NAME: CAP; CDS_PART_NAME: CAP_0603-602433-081,X5R,22UF,6.3V,20%,LPDB,GENERIC; CDS_LOCATION: C23803
C23804 = CAP: CDS_PHYS_PART_NAME: CAP_0603-602433-081,X5R,22UF,6.3V,20%,LPDB,GENERIC; OriginalSymbolOrigin: (-50,25); XY: (-2625,4250); VER: 1; ROT: 0; PHYS_PAGE: 238; LOCATION: C23804; DRAWING: @RVP1_ADL_SB_ADP_S_DDR5_SODIMM_2DPC_LIB.H55_DG2_2DPC(SCH_1):PAGE409; CDS_LIB: discrete; PCB Footprint: SMC0603ID; CHIPS_PART_NAME: CAP; CDS_PART_NAME: CAP_0603-602433-081,X5R,22UF,6.3V,20%,LPDB,GENERIC; CDS_LOCATION: C23804
C23805 = CAP: CDS_PHYS_PART_NAME: CAP_0603-602433-081,X5R,22UF,6.3V,20%,LPDB,GENERIC; OriginalSymbolOrigin: (-50,25); XY: (-2175,4250); VER: 1; ROT: 0; PHYS_PAGE: 238; LOCATION: C23805; DRAWING: @RVP1_ADL_SB_ADP_S_DDR5_SODIMM_2DPC_LIB.H55_DG2_2DPC(SCH_1):PAGE409; CDS_LIB: discrete; PCB Footprint: SMC0603ID; CHIPS_PART_NAME: CAP; CDS_PART_NAME: CAP_0603-602433-081,X5R,22UF,6.3V,20%,LPDB,GENERIC; CDS_LOCATION: C23805
C23806 = CAP: CDS_PHYS_PART_NAME: CAP_0603-602433-081,X5R,22UF,6.3V,20%,LPDB,GENERIC; OriginalSymbolOrigin: (-50,25); XY: (-1725,4250); VER: 1; ROT: 0; PHYS_PAGE: 238; LOCATION: C23806; DRAWING: @RVP1_ADL_SB_ADP_S_DDR5_SODIMM_2DPC_LIB.H55_DG2_2DPC(SCH_1):PAGE409; CDS_LIB: discrete; PCB Footprint: SMC0603ID; CHIPS_PART_NAME: CAP; CDS_PART_NAME: CAP_0603-602433-081,X5R,22UF,6.3V,20%,LPDB,GENERIC; CDS_LOCATION: C23806
C23807 = CAP: CDS_PHYS_PART_NAME: CAP_0603-602433-081,X5R,22UF,6.3V,20%,LPDB,GENERIC; OriginalSymbolOrigin: (-50,25); XY: (-1275,4250); VER: 1; ROT: 0; PHYS_PAGE: 238; LOCATION: C23807; DRAWING: @RVP1_ADL_SB_ADP_S_DDR5_SODIMM_2DPC_LIB.H55_DG2_2DPC(SCH_1):PAGE409; CDS_LIB: discrete; PCB Footprint: SMC0603ID; CHIPS_PART_NAME: CAP; CDS_PART_NAME: CAP_0603-602433-081,X5R,22UF,6.3V,20%,LPDB,GENERIC; CDS_LOCATION: C23807
C23808 = CAP: CDS_PHYS_PART_NAME: CAP_0603-602433-081,X5R,22UF,6.3V,20%,LPDB,GENERIC; OriginalSymbolOrigin: (-50,25); XY: (-800,4250); VER: 1; ROT: 0; PHYS_PAGE: 238; LOCATION: C23808; DRAWING: @RVP1_ADL_SB_ADP_S_DDR5_SODIMM_2DPC_LIB.H55_DG2_2DPC(SCH_1):PAGE409; CDS_LIB: discrete; PCB Footprint: SMC0603ID; CHIPS_PART_NAME: CAP; CDS_PART_NAME: CAP_0603-602433-081,X5R,22UF,6.3V,20%,LPDB,GENERIC; CDS_LOCATION: C23808